# EAGLE board moteus_n1 (EAGLE 9.6.0)
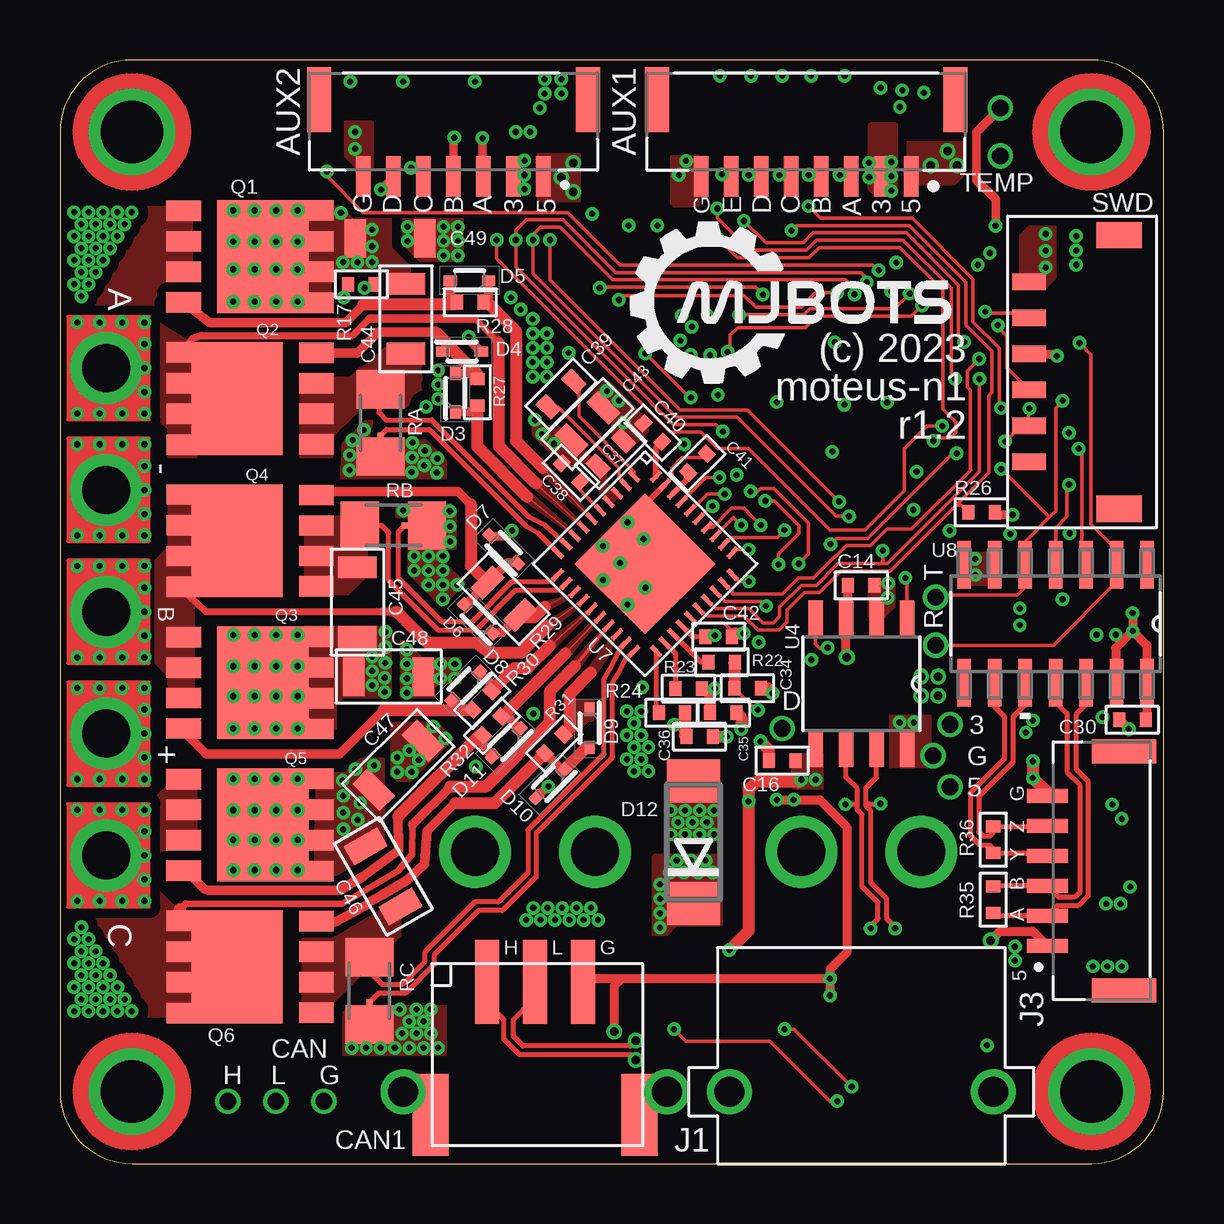
[diagram p8: board, top side]
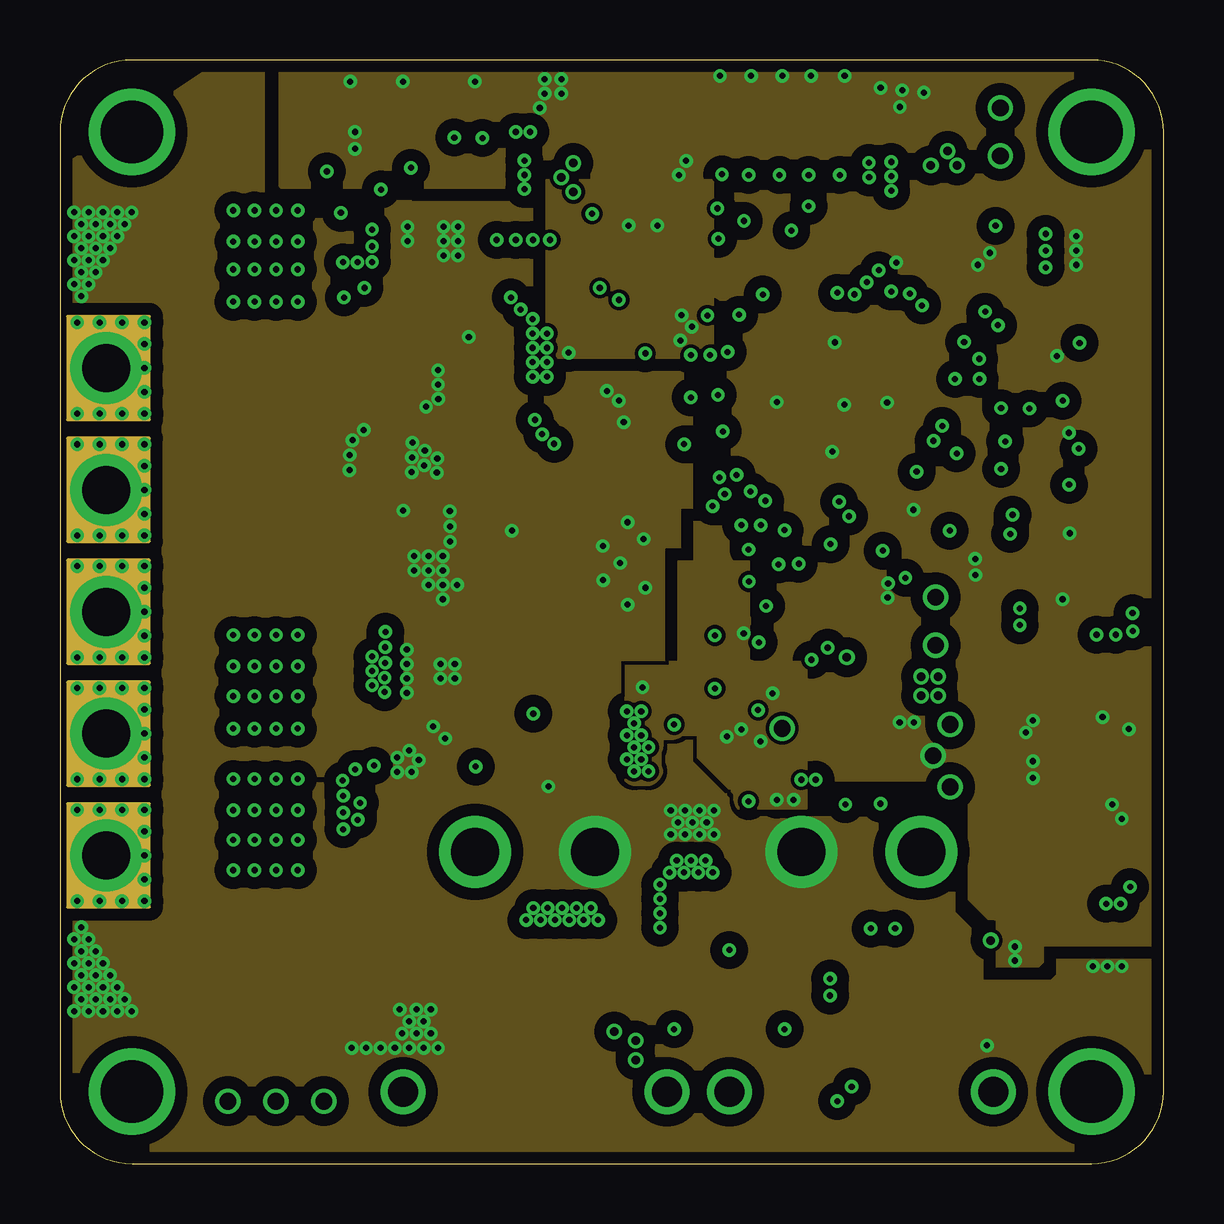
[diagram p9: board, inner layer Route2]
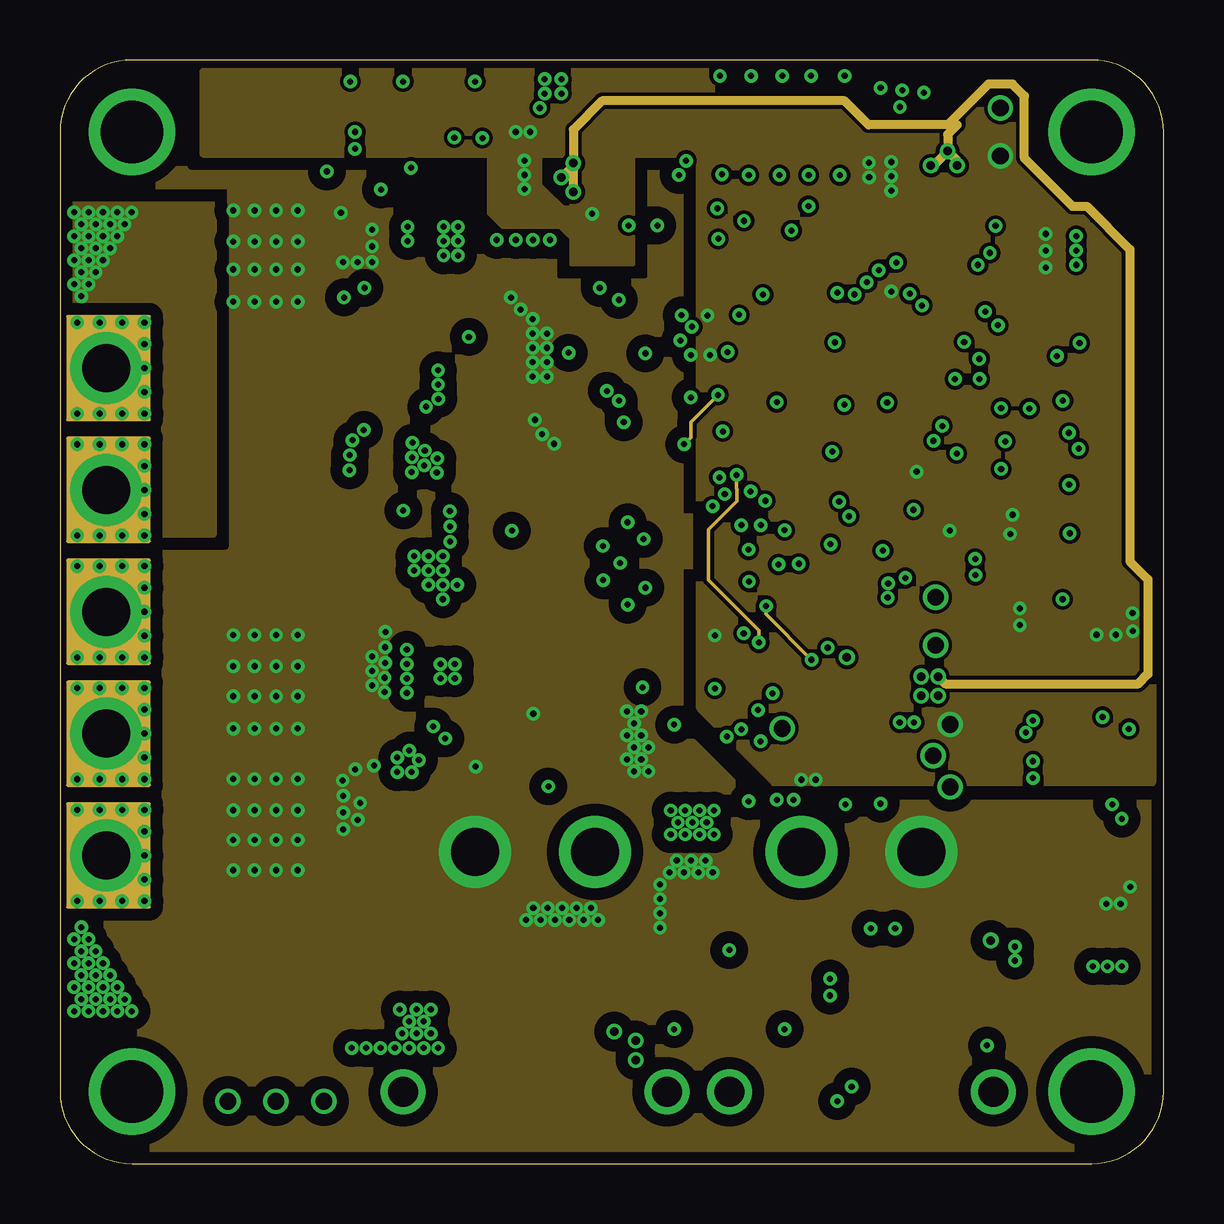
[diagram p10: board, inner layer Route15]
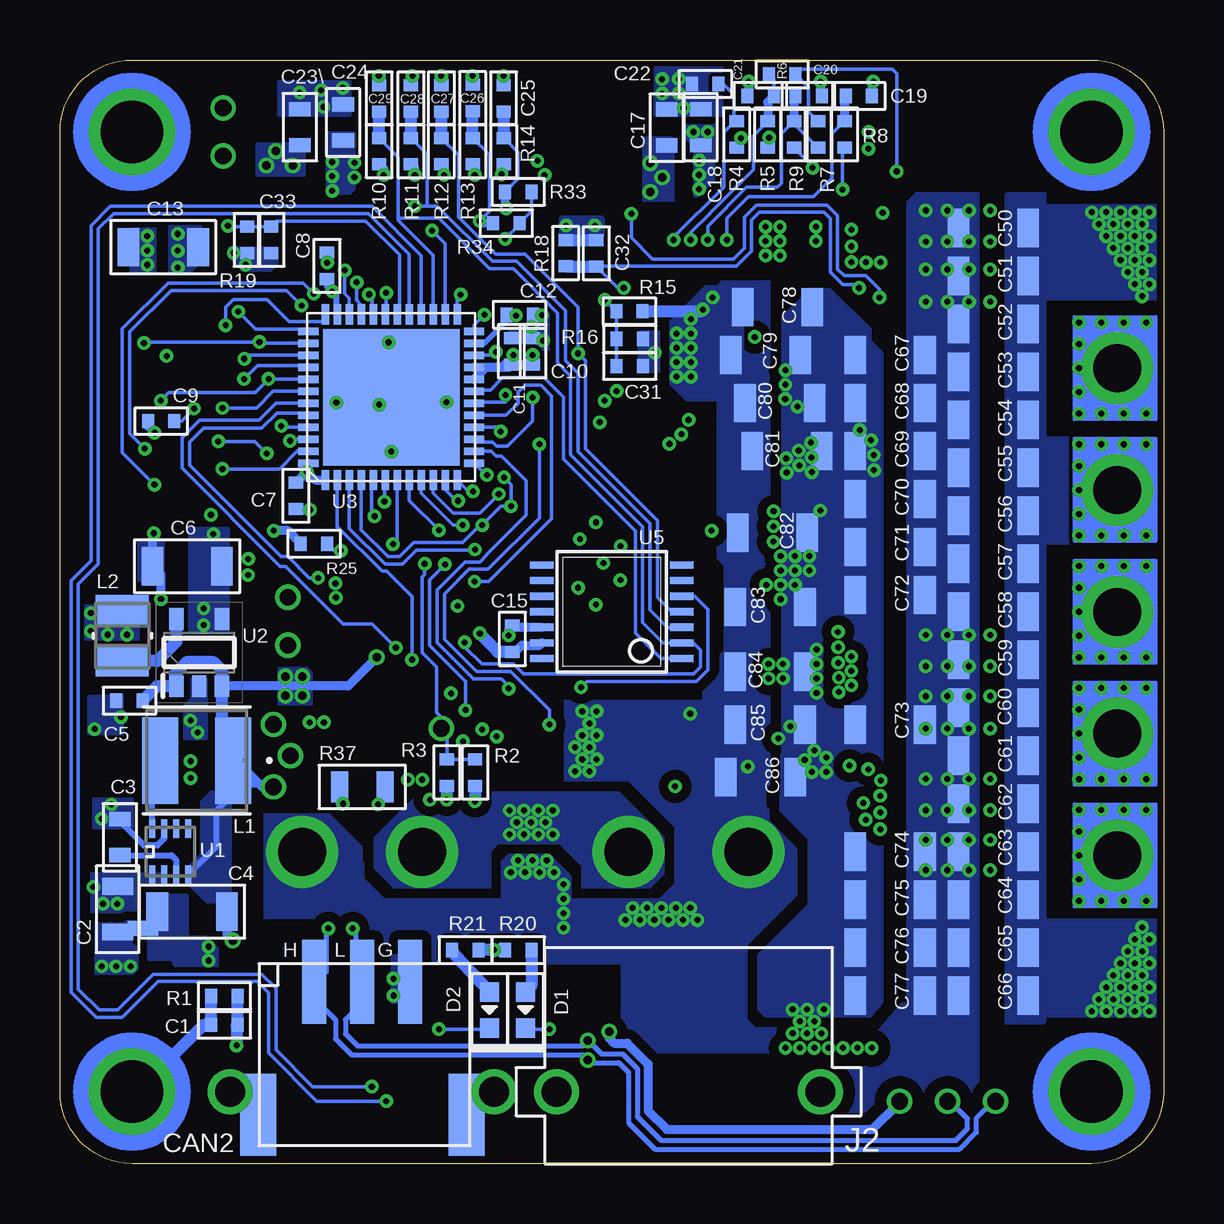
[diagram p11: board, bottom side, seen from below]

Size 46 x 46 mm. Coordinates in mm from the lower left corner, seen from the top.
Outline: 0,43 0,3 arc90 3,0 43,0 arc90 46,3 46,43 arc90 43,46 3,46 arc90 0,43
Copper layers (1*2*15*16): Top 0.07mm / dielectric 0.23mm / Route2 0.035mm / dielectric 0.93mm / Route15 0.035mm / dielectric 0.23mm / Bottom 0.07mm
Design rules "MF_4_mil_drill_4_Layer *": minimum track width 6mil, minimum drill 10mil, track to track 6mil, track to pad 6mil, pad to pad 6mil, via to via 6mil, smd to smd 0mil, copper to edge 10mil, drill to drill 10mil, minimum pad ring 6mil, minimum via ring 6mil, stop-mask expansion 2mil, vias tented up to drill 25mil, thermal gap 10mil
Net classes: 0 default: width 0.127 mm; 1 CAN: width 0.216 mm, clearance 0.127 mm; 2 HV: clearance 0.13 mm; 3 GATE: width 0.384 mm

## Footprints (pad centres in the part's own frame; a part is rotated, then mirrored left to right if it is on the bottom)
16AWG_TERM = drill 2: 1 0,0 | drill 0.254: 2 -1.9,1.6; 3 -1.9,0.667; 4 -1.9,-0.267; 5 -1.9,-1.2; 6 -1,1.6; 7 1.9,1.6; 8 1,1.6; 9 1.9,0.667; 10 1.9,-0.267; 11 1.9,-1.2; 12 0,1.6
JST_SM08B-GHS-TB(LF)(SN) = smd 0.6 x 1.7: 1 -4.375,0; 2 -3.125,0; 3 -1.875,0; 4 -0.625,0; 5 0.625,0; 6 1.875,0; 7 3.125,0; 8 4.375,0 | smd 1 x 2.7: SH1 -6.225,-3.2; SH2 6.225,-3.2
JST_SM07B-GHS-TB(LF)(SN) = smd 0.6 x 1.7: 1 -3.75,1.85; 2 -2.5,1.85; 3 -1.25,1.85; 4 0,1.85; 5 1.25,1.85; 6 2.5,1.85; 7 3.75,1.85 | smd 1 x 2.7: S1 5.6,-1.35; S2 -5.6,-1.35
C0402 = smd 0.5 x 0.6: P$1 -0.55,0; P$2 0.55,0
C0805 = smd 0.7 x 1.3: P$1 -0.95,0; P$2 0.95,0
C0603 = smd 0.6 x 0.9: P$1 -0.75,0; P$2 0.75,0
C1206 = smd 0.9 x 1.6: P$1 -1.45,0; P$2 1.45,0
C1206_NOBORDER = smd 0.9 x 1.6: P$1 -1.45,0; P$2 1.45,0
JST_S3B-PH-SM4-TB(LF)(SN) = smd 1 x 3.5: 1 2,-2.98; 2 0,-2.98; 3 -2,-2.98 | smd 1.5 x 3.4: S1 -4.35,2.57; S2 4.35,2.57
24AWG_PAD = drill 0.7: P$1 0,0
LED0603 = smd 0.8 x 0.8: ANODE 0.75,0; CATHODE -0.75,0
SODFL1608X70N = smd 0.55 x 0.42: 1 -0.8,0; 2 0.8,0
DO214AA = smd 1.8 x 2.2: A 2.55,0; C -2.55,0
XT30PW_MALE = drill 2: 1 -2.5,0; 2 2.5,0 | drill 1.25: M1 -5.5,10; M2 5.5,10
JST_SM06B-GHS-TB(LF)(SN) = smd 0.6 x 1.7: 1 -3.125,1.85; 2 -1.875,1.85; 3 -0.625,1.85; 4 0.625,1.85; 5 1.875,1.85; 6 3.125,1.85 | smd 1 x 2.7: S1 4.975,-1.35; S2 -4.975,-1.35
IND_BOURNS_SRN4018 = smd 1.499 x 3.607: 1 -1.524,0; 2 1.524,0
IND_4024100_WRE = smd 1.295 x 2.21: 1 -1.054,0; 2 1.054,0
M2.5MOUNT = drill 2.6: P$1 0,0
SOP_ADVANCE_8_VIAS = smd 0.85 x 1.45: 1 -1.905,-2.95; 2 -0.635,-2.95; 3 0.635,-2.95; 4 1.905,-2.95 | smd 0.85 x 1.1: 5 1.925,2.75; 6 0.637,2.75; 7 -0.637,2.75; 8 -1.925,2.75 | smd 4.7 x 3.8: PAD 0,0.35
SOP_ADVANCE_8 = smd 0.85 x 1.45: 1 -1.905,-2.95; 2 -0.635,-2.95; 3 0.635,-2.95; 4 1.905,-2.95 | smd 0.85 x 1.1: 5 1.925,2.75; 6 0.637,2.75; 7 -0.637,2.75; 8 -1.925,2.75 | smd 4.7 x 3.8: PAD 0,0.35
R0402 = smd 0.5 x 0.6: P$1 -0.55,0; P$2 0.55,0
R0805 = smd 0.7 x 1.3: P$1 -0.95,0; P$2 0.95,0
M1206 = smd 1.6 x 2: 1 -1.4,0; 2 1.4,0
SHORT_TOP-50 = smd 0.254 x 0.254: 1 0.127,0; 2 -0.127,0
SHORT_TOP-MEDIUM = smd 0.635 x 0.635: 1 0.318,0; 2 -0.318,0
JST_S6B-ZR-SM4A-TF(LF)(SN) = smd 0.7 x 1.4: 1 3.75,0; 2 2.25,0; 3 0.75,0; 4 -0.75,0; 5 -2.25,0; 6 -3.75,0 | smd 1.1 x 1.9: P1 5.7,3.75; P2 -5.7,3.75
21-0487A_MXM = smd 0.762 x 0.254: 1 -0.953,0.75; 2 -0.953,0.25; 3 -0.953,-0.25; 4 -0.953,-0.75; 5 0.953,-0.75; 6 0.953,-0.25; 7 0.953,0.25; 8 0.953,0.75
SOT95P280X130-5N = smd 0.9 x 0.6: 1 -1.4,0.95; 2 -1.4,0; 3 -1.4,-0.95; 4 1.4,-0.95; 5 1.4,0.95
QFN50P700X700X60-49N = smd 0.85 x 0.3: 1 -3.45,2.75; 2 -3.45,2.25; 3 -3.45,1.75; 4 -3.45,1.25; 5 -3.45,0.75; 6 -3.45,0.25; 7 -3.45,-0.25; 8 -3.45,-0.75; 9 -3.45,-1.25; 10 -3.45,-1.75; 11 -3.45,-2.25; 12 -3.45,-2.75; 25 3.45,-2.75; 26 3.45,-2.25; 27 3.45,-1.75; 28 3.45,-1.25; 29 3.45,-0.75; 30 3.45,-0.25; 31 3.45,0.25; 32 3.45,0.75; 33 3.45,1.25; 34 3.45,1.75; 35 3.45,2.25; 36 3.45,2.75 | smd 0.3 x 0.85: 13 -2.75,-3.45; 14 -2.25,-3.45; 15 -1.75,-3.45; 16 -1.25,-3.45; 17 -0.75,-3.45; 18 -0.25,-3.45; 19 0.25,-3.45; 20 0.75,-3.45; 21 1.25,-3.45; 22 1.75,-3.45; 23 2.25,-3.45; 24 2.75,-3.45; 37 2.75,3.45; 38 2.25,3.45; 39 1.75,3.45; 40 1.25,3.45; 41 0.75,3.45; 42 0.25,3.45; 43 -0.25,3.45; 44 -0.75,3.45; 45 -1.25,3.45; 46 -1.75,3.45; 47 -2.25,3.45; 48 -2.75,3.45 | smd 5.7 x 5.7: 49 0,0
SOIC8 = smd 1.549 x 0.61: 1 -2.7,1.905; 2 -2.7,0.635; 3 -2.7,-0.635; 4 -2.7,-1.905; 5 2.7,-1.905; 6 2.7,-0.635; 7 2.7,0.635; 8 2.7,1.905
TSSOP14 = smd 0.305 x 0.991: 1 -1.95,-2.918; 2 -1.3,-2.918; 3 -0.65,-2.918; 4 0,-2.918; 5 0.65,-2.918; 6 1.3,-2.918; 7 1.95,-2.918; 8 1.95,2.918; 9 1.3,2.918; 10 0.65,2.918; 11 0,2.918; 12 -0.65,2.918; 13 -1.3,2.918; 14 -1.95,2.918
WQFN-40 = smd 0.22 x 0.6: 1 2.25,2.9; 2 1.75,2.9; 3 1.25,2.9; 4 0.75,2.9; 5 0.25,2.9; 6 -0.25,2.9; 7 -0.75,2.9; 8 -1.25,2.9; 9 -1.75,2.9; 10 -2.25,2.9; 21 -2.25,-2.9; 22 -1.75,-2.9; 23 -1.25,-2.9; 24 -0.75,-2.9; 25 -0.25,-2.9; 26 0.25,-2.9; 27 0.75,-2.9; 28 1.25,-2.9; 29 1.75,-2.9; 30 2.25,-2.9 | smd 0.6 x 0.22: 11 -2.9,2.25; 12 -2.9,1.75; 13 -2.9,1.25; 14 -2.9,0.75; 15 -2.9,0.25; 16 -2.9,-0.25; 17 -2.9,-0.75; 18 -2.9,-1.25; 19 -2.9,-1.75; 20 -2.9,-2.25; 31 2.9,-2.25; 32 2.9,-1.75; 33 2.9,-1.25; 34 2.9,-0.75; 35 2.9,-0.25; 36 2.9,0.25; 37 2.9,0.75; 38 2.9,1.25; 39 2.9,1.75; 40 2.9,2.25 | smd 4.15 x 4.15: PAD 0,0
D14 = smd 1.981 x 0.559: 1 -2.464,3.81; 2 -2.464,2.54; 3 -2.464,1.27; 4 -2.464,0; 5 -2.464,-1.27; 6 -2.464,-2.54; 7 -2.464,-3.81; 8 2.464,-3.81; 9 2.464,-2.54; 10 2.464,-1.27; 11 2.464,0; 12 2.464,1.27; 13 2.464,2.54; 14 2.464,3.81

## Placement (x,y rotation side)
A  PAD16AWG_TERM  [16AWG_TERM]  1.92,33.16 90 bottom
AUX1  SM08B-GHS-TB(LF)(SN)  [JST_SM08B-GHS-TB(LF)(SN)]  31.1,41.15 180 top
AUX2  SM07B-GHS-TB(LF)(SN)  [JST_SM07B-GHS-TB(LF)(SN)]  16.4,43 180 top
B  PAD16AWG_TERM  [16AWG_TERM]  1.92,23 90 bottom
C  PAD16AWG_TERM  [16AWG_TERM]  1.92,12.84 90 bottom
C1  DNP  [C0402]  39.15,5.78 0 bottom
C2  1uF 100V  [C0805]  43.6,10.6 270 bottom
C3  1uF  [C0603]  43.5,13.6 90 bottom
C4  10uF  [C1206]  40.5,10.5 180 bottom
C5  1uF  [C0402]  43.1,19.3 180 bottom
C6  22uF  [C1206]  40.7,24.9 180 bottom
C7  0.1uF  [C0402]  36.16,27.83 270 bottom
C8  0.1uF  [C0402]  34.87,37.42 90 bottom
C9  0.1uF  [C0402]  41.78,30.95 180 bottom
C10  1uF  [C0402]  26.28,33.86 90 bottom
C11  0.1uF  [C0402]  27.18,33.86 90 bottom
C12  0.1uF  [C0402]  26.84,35.38 0 bottom
C13  10uF  [C1206]  41.69,38.2 0 bottom
C14  0.1uF  [C0402]  33.4,24.1 0 top
C15  0.1uF  [C0402]  27.14,21.87 270 bottom
C16  0.1uF  [C0402]  30.1,16.8 180 top
C17  1uF  [C0603]  20.71,43.18 90 bottom
C18  1uF  [C0603]  19.3,43.2 90 bottom
C19  DNP  [C0402]  12.7,44.5 0 bottom
C20  DNP  [C0402]  14.8,44.5 0 bottom
C21  DNP  [C0402]  16.8,44.5 180 bottom
C22  DNP  [C0402]  19.1,45 180 bottom
C23\  1uF  [C0603]  36,43.2 90 bottom
C24  1uF  [C0603]  34.2,43.4 90 bottom
C25  DNP  [C0402]  27.51,44.4 90 bottom
C26  DNP  [C0402]  28.8,44.41 90 bottom
C27  DNP  [C0402]  30.1,44.4 90 bottom
C28  DNP  [C0402]  31.37,44.4 90 bottom
C29  DNP  [C0402]  32.7,44.4 90 bottom
C30  0.1uF  [C0402]  44.7,18.5 180 top
C31  0.01uF  [C0402]  22.25,33.24 0 bottom
C32  0.1uF  [C0402]  23.64,37.94 90 bottom
C33  0.1uF  [C0402]  37.2,38.5 270 bottom
C34  1000pF  [C0402]  28.66,19.81 0 top
C35  1000pF  [C0402]  27.65,18.79 0 top
C36  1000pF  [C0402]  26.66,17.79 0 top
C37  0.1uF 100V  [C0603]  22.96,29.6 45 top
C38  1uF  [C0402]  21.3,28.8 315 top
C39  0.1uF 100V  [C0603]  20.89,32.07 45 top
C40  1uF  [C0402]  24.71,30.47 315 top
C41  1uF  [C0402]  26.57,29.19 225 top
C42  0.1uF  [C0402]  27.46,21.96 180 top
C43  0.47uF 100V  [C0805]  21.99,30.83 45 top
C44  0.1uF 100V  [C1206]  14.42,35.21 270 top
C45  0.1uF 100V  [C1206]  12.4,23.4 90 top
C46  0.1uF 100V  [C1206]  13.47,11.97 300 top
C47  4.7uF 100V  [C1206]  14.1,16.6 45 top
C48  4.7uF 100V  [C1206]  13.7,20.3 0 top
C49  4.7uF 100V  [C1206_NOBORDER]  13.76,38.57 0 top
C50  4.7uF 100V  [C1206_NOBORDER]  7.1,39 0 bottom
C51  4.7uF 100V  [C1206_NOBORDER]  7.1,37 0 bottom
C52  4.7uF 100V  [C1206_NOBORDER]  7.1,35 0 bottom
C53  4.7uF 100V  [C1206_NOBORDER]  7.1,33 0 bottom
C54  4.7uF 100V  [C1206_NOBORDER]  7.1,31 0 bottom
C55  4.7uF 100V  [C1206_NOBORDER]  7.1,29 0 bottom
C56  4.7uF 100V  [C1206_NOBORDER]  7.1,27 0 bottom
C57  4.7uF 100V  [C1206_NOBORDER]  7.1,25 0 bottom
C58  4.7uF 100V  [C1206_NOBORDER]  7.1,23 0 bottom
C59  4.7uF 100V  [C1206_NOBORDER]  7.1,21 0 bottom
C60  4.7uF 100V  [C1206_NOBORDER]  7.1,19 0 bottom
C61  4.7uF 100V  [C1206_NOBORDER]  7.1,17 0 bottom
C62  4.7uF 100V  [C1206_NOBORDER]  7.1,15 0 bottom
C63  4.7uF 100V  [C1206_NOBORDER]  7.1,13 0 bottom
C64  4.7uF 100V  [C1206_NOBORDER]  7.1,11 0 bottom
C65  4.7uF 100V  [C1206_NOBORDER]  7.1,9 0 bottom
C66  4.7uF 100V  [C1206_NOBORDER]  7.1,7 0 bottom
C67  4.7uF 100V  [C1206_NOBORDER]  11.4,33.7 180 bottom
C68  4.7uF 100V  [C1206_NOBORDER]  11.4,31.7 180 bottom
C69  4.7uF 100V  [C1206_NOBORDER]  11.4,29.7 180 bottom
C70  4.7uF 100V  [C1206_NOBORDER]  11.4,27.7 180 bottom
C71  4.7uF 100V  [C1206_NOBORDER]  11.4,25.7 180 bottom
C72  4.7uF 100V  [C1206_NOBORDER]  11.4,23.7 180 bottom
C73  4.7uF 100V  [C1206_NOBORDER]  11.4,18.3 180 bottom
C74  4.7uF 100V  [C1206_NOBORDER]  11.4,13 180 bottom
C75  4.7uF 100V  [C1206_NOBORDER]  11.4,11 180 bottom
C76  4.7uF 100V  [C1206_NOBORDER]  11.4,9 180 bottom
C77  4.7uF 100V  [C1206_NOBORDER]  11.4,7 180 bottom
C78  4.7uF 100V  [C1206_NOBORDER]  16.1,35.7 0 bottom
C79  4.7uF 100V  [C1206_NOBORDER]  16.6,33.7 0 bottom
C80  4.7uF 100V  [C1206_NOBORDER]  16,31.7 0 bottom
C81  4.7uF 100V  [C1206_NOBORDER]  15.7,29.7 0 bottom
C82  4.7uF 100V  [C1206_NOBORDER]  16.3,26.3 0 bottom
C83  4.7uF 100V  [C1206_NOBORDER]  16.4,23.2 0 bottom
C84  4.7uF 100V  [C1206_NOBORDER]  16.4,20.5 0 bottom
C85  4.7uF 100V  [C1206_NOBORDER]  16.4,18.3 0 bottom
C86  4.7uF 100V  [C1206_NOBORDER]  16.8,16.1 0 bottom
CAN1  JST-PH3  [JST_S3B-PH-SM4-TB(LF)(SN)]  19.8,4.6 180 top
CAN2  JST-PH3  [JST_S3B-PH-SM4-TB(LF)(SN)]  33.4,4.6 180 bottom
CANG  PAD24AWG_PAD  [24AWG_PAD]  11,2.6 0 top
CANH  PAD24AWG_PAD  [24AWG_PAD]  7,2.6 0 top
CANL  PAD24AWG_PAD  [24AWG_PAD]  9,2.6 0 top
D1  MF-LED-0603-RED  [LED0603]  26.6,6.4 90 bottom
D2  MF-LED-0603-RED  [LED0603]  28.1,6.4 90 bottom
D3  BAT41KFILM  [SODFL1608X70N]  16.48,32.13 90 top
D4  BAT41KFILM  [SODFL1608X70N]  16.76,33.85 0 top
D5  BAT41KFILM  [SODFL1608X70N]  17.07,36.81 180 top
D6  BAT41KFILM  [SODFL1608X70N]  17.45,22.7 135 top
D7  BAT41KFILM  [SODFL1608X70N]  18.5,25.6 135 top
D8  BAT41KFILM  [SODFL1608X70N]  16.91,19.91 225 top
D9  BAT41KFILM  [SODFL1608X70N]  22.07,18.14 270 top
D10  BAT41KFILM  [SODFL1608X70N]  20.43,15.83 225 top
D11  BAT41KFILM  [SODFL1608X70N]  18.61,17.54 225 top
D12  [DO214AA]  26.4,13.4 90 top
D33  PAD24AWG_PAD  [24AWG_PAD]  37.1,18.3 0 top
D50  PAD24AWG_PAD  [24AWG_PAD]  37.1,15.7 0 top
DAC  PAD24AWG_PAD  [24AWG_PAD]  30.1,18.14 180 top
DG1  PAD24AWG_PAD  [24AWG_PAD]  36.4,17 0 top
DTR  PAD24AWG_PAD  [24AWG_PAD]  36.5,21.6 0 top
DTX  PAD24AWG_PAD  [24AWG_PAD]  36.5,23.6 0 top
J1  XT30XT30PW_MALE  [XT30PW_MALE]  33.4,13 180 top
J2  XT30XT30PW_MALE  [XT30PW_MALE]  19.8,13 180 bottom
J3  SM06B-GHS-TB(LF)(SN)  [JST_SM06B-GHS-TB(LF)(SN)]  43,12.2 90 top
L1  SRN4018-220M  [IND_BOURNS_SRN4018]  40.3,16.8 180 bottom
L2  74404024100  [IND_4024100_WRE]  43.4,22 270 bottom
M1  MOUNT  [M2.5MOUNT]  3,3 0 top
M2  MOUNT  [M2.5MOUNT]  3,43 0 top
M3  MOUNT  [M2.5MOUNT]  43,3 0 top
M4  MOUNT  [M2.5MOUNT]  43,43 0 top
Q1  TPH1R204PL_VIAS  [SOP_ADVANCE_8_VIAS]  8.11,37.8 270 top
Q2  TPH1R204PLSOP_ADVANCE_8  [SOP_ADVANCE_8]  7.74,31.88 90 top
Q3  TPH1R204PL_VIAS  [SOP_ADVANCE_8_VIAS]  8.11,20.04 270 top
Q4  TPH1R204PLSOP_ADVANCE_8  [SOP_ADVANCE_8]  7.74,25.96 90 top
Q5  TPH1R204PL_VIAS  [SOP_ADVANCE_8_VIAS]  8.11,14.12 270 top
Q6  TPH1R204PLSOP_ADVANCE_8  [SOP_ADVANCE_8]  7.74,8.2 90 top
R1  DNP  [R0402]  39.15,6.98 0 bottom
R2  DNP  [R0402]  28.7,16.3 270 bottom
R3  100k 1%  [R0402]  29.87,16.3 90 bottom
R4  100  [R0402]  17.8,42.9 90 bottom
R5  100  [R0402]  16.5,42.9 90 bottom
R6  2k  [R0402]  15.9,45.4 180 bottom
R7  2k  [R0402]  14.4,42.9 270 bottom
R8  100  [R0402]  13.3,42.9 90 bottom
R9  100  [R0402]  15.4,42.9 90 bottom
R10  100  [R0402]  32.7,42.2 90 bottom
R11  100  [R0402]  31.37,42.2 90 bottom
R12  100  [R0402]  30.11,42.2 90 bottom
R13  100  [R0402]  28.8,42.2 90 bottom
R14  100  [R0402]  27.5,42.2 90 bottom
R15  100k 1%  [R0402]  22.26,35.53 0 bottom
R16  4.7k 1%  [R0402]  22.25,34.37 180 bottom
R17  47k NTC  [R0402]  12.56,36.65 0 top
R18  10k 1%  [R0402]  24.92,37.95 90 bottom
R19  10k 1%  [R0402]  38.2,38.5 270 bottom
R20  560  [R0402]  26.9,8.9 0 bottom
R21  560  [R0402]  29.1,8.9 180 bottom
R22  22  [R0402]  27.59,20.9 0 top
R23  22  [R0402]  26.2,19.8 0 top
R24  22  [R0402]  25.51,18.8 0 top
R25  2k  [R0402]  35.41,25.84 0 bottom
R26  2k  [R0402]  38.41,27.14 180 top
R27  7.5  [R0402]  17.4,32.15 90 top
R28  7.5  [R0402]  17.1,35.9 180 top
R29  7.5  [R0805]  18.5,23.54 135 top
R30  7.5  [R0402]  17.6,19.3 225 top
R31  7.5  [R0402]  20.6,17.5 225 top
R32  7.5  [R0402]  18.02,18.24 225 top
R33  2k  [R0402]  26.9,40.5 180 bottom
R34  2k  [R0402]  27.4,39.2 180 bottom
R35  120  [R0402]  38.9,11 270 top
R36  120  [R0402]  38.9,13.5 270 top
R37  DNP  [R0805]  33.4,15.7 0 bottom
RA  0.5mOhm 1% 2W  [M1206]  13.36,30.87 90 top
RB  0.5mOhm 1% 2W  [M1206]  13.9,26.6 180 top
RC  0.5mOhm 1% 2W  [M1206]  12.9,7.2 90 top
SH1  SHORTT5  [SHORT_TOP-50]  13.36,30.22 90 top
SH2  SHORTT5  [SHORT_TOP-50]  14.5,26.6 180 top
SH3  SHORTT5  [SHORT_TOP-50]  12.9,6.6 90 top
SH4  SHORTMEDIUM  [SHORT_TOP-MEDIUM]  42.54,9.8 180 bottom
SWD  JST-ZH6  [JST_S6B-ZR-SM4A-TF(LF)(SN)]  40.4,33 270 top
TEMP1  PAD24AWG_PAD  [24AWG_PAD]  39.2,42 0 top
TEMP2  PAD24AWG_PAD  [24AWG_PAD]  39.2,44 0 top
U1  MAX15062AATA+T  [21-0487A_MXM]  41.4,13 90 bottom
U2  XC9265A331MR-G  [SOT95P280X130-5N]  40.2,21.3 90 bottom
U3  STM32G474CEU6  [QFN50P700X700X60-49N]  32.19,31.94 90 bottom
U4  TCAN1042HGV  [SOIC8]  33.4,20 270 top
U5  AS5147  [TSSOP14]  23,23 90 bottom
U7  DRV8353S  [WQFN-40]  24.39,25 45 top
U8  SN65HVD35DR  [D14]  41.5,22.5 270 top
VN  PAD16AWG_TERM  [16AWG_TERM]  1.92,28.08 90 bottom
VP  PAD16AWG_TERM  [16AWG_TERM]  1.92,17.92 90 bottom

## Tracks (layer width: path | path; a pad name or v marks a point on that pad's centre or on a via)
+3V3  (via drill 0.25)
  Top 0.152: R17.P$1 11.84,36.48 v11.84,36.1
  Top 0.2: U7.24 26.37,21.96 C42.P$2
  Top 0.384: AUX2.2 18.96,41.21 v19.36,41.21 | C42.P$2 26.96,22.01 v27.3,22.01 | v44.72,22.19 45.31,21.6 U8.14 45.31,18.56 C30.P$1 | v44.71,22.94 v44.72,22.93 v44.72,22.19 | U8.13 44.01,20.07 44.01,21.48 v44.72,22.19 | v39.71,27.04 39.06,27.04 R26.P$1
  Top 0.5: v30.9,16 30.8,15.9 29,15.9 28.7,15.6 v28.7,15.1 28.7,9.7 v27.9,8.9
  Bottom 0.152: v11.84,36.1 11.84,36.44 12.41,37.01 13.31,37.01 13.59,37.29 13.59,39.52 14.02,39.95 16.98,39.95 17.48,39.46 17.48,38.16 17.93,37.7 21.3,37.7 22.18,38.59 v22.18,39.59
  Bottom 0.2: U3.23 28.31,34.19 28.06,34.44 27.39,35.11 C12.P$1
  Bottom 0.25: C8.P$1 34.87,36.57 v34.65,36.35 34.49,36.19 34.49,35.44 U3.35
  Bottom 0.384: v27.3,22.01 27.3,22.26 C15.P$1 27.07,22.35 U5.12 | U3.20 28.23,33.2 27.57,33.2 27.46,33.31 C11.P$1 | U3.21 27.3,33.19 C11.P$1 | C11.P$1 C10.P$1 26.3,33.33 v26.3,33.7 | v27.1,33.7 27.1,33.39 C11.P$1 | C12.P$1 27.36,35.35 v26.99,35.35 | U3.48 35.71,29.12 v35.71,28.84 | v35.71,28.84 C7.P$1 | v35.71,28.84 35.36,28.49 U3.1 | R25.P$1 36.5,26.38 v37.09,26.38
  Bottom 0.5: R2.P$2 v28.7,15.1 | R21.P$1 v27.9,8.9 R20.P$1
  other vias: 19,43 19.6,43 19.36,41.81 19.36,40.62 31.5,16 33.73,41.11 33.72,41.72 34.65,41.75 34.65,41.15 34.65,40.55 41.09,38.75 41.09,38.05 41.09,37.35 44.01,22.04 43.21,22.04 40.01,23.14 40.01,22.44 39.61,26.24
  pour Route15 (no thermals): 6,45.5 41.9,45.5 45.4,42 45.5,42 45.5,15.9 29.8,15.9 26.7,19 26.7,42.1 6,42.1
  pour Bottom (no thermals): 40.6,26.5 39,26.5 39,22.2 40.6,22.2
  pour Route15 (no thermals): 21.3,42.3 23.9,42.3 23.9,37.45 21.3,37.45
  pour Bottom (no thermals): 18.7,43.3 19.9,43.3 19.9,42.7 19.6,42.4 19.6,40.3 19.4,40.3 18.8,40.9 18.7,41
  pour Top (no thermals): 30.5,17.1 31.8,17.1 31.8,15.6 30.6,15.6 30.5,15.7
  pour Top (no thermals): 33.8,43.4 34.8,43.4 34.9,43.3 34.9,40.4 33.9,40.4 33.7,40.6 33.7,42.4 33.7,43.3
  pour Bottom (no thermals): 33.7,43 34.9,43 34.9,40.4 33.9,40.4 33.7,40.6
  pour Top (no thermals): 40.4,39.1 41.5,39.1 41.5,36.9 41.1,36.5 40.7,36.5 40,36.5 40,38.7
  pour Bottom (no thermals): 40.1,39.1 41.5,39.1 41.5,37.1 40.6,37.1 40.1,37.6
  pour Bottom (no thermals): 45,23.3 42.7,23.3 42.7,21.8 45,21.8
  pour Route15 (no thermals): 21.7,39.9 21,39.9 20.3,40.6 20.1,40.8 20.1,42.4 18.1,42.4 17.8,42.1 17.8,39.6 18.4,39 20.8,39 21.5,38.3 21.7,38.3
+5V  (via drill 0.35)
  Top 0.384: v38.8,9.3 39.18,9.68 40.54,9.68 J3.1 | v32.8,21.1 32.77,21.14 U4.3 32.85,22.79 C14.P$1
  Route15 0.384: v36.6,20.3 36.9,20 44.95,20 45.35,20.4 45.35,24.35 44.6,25.1 44.6,38.1 42.8,39.9 42.2,39.9 40.2,41.9 40.2,44.5 39.7,45 38.7,45 37,43.3 | v37,42.2 37,42.9 37.4,43.3 37,43.3 | v37,42.2 37.4,41.8 v37.4,41.6 | v37,42.2 36.4,41.6 v36.3,41.6 | 37,43.3 33.7,43.3 32.7,44.3 22.6,44.3 21.4,43.1 v21.4,41.7 | v21.4,40.5 v21.4,41.7 | v21.4,41.7 21.4,41.6 v20.9,41.1
  Bottom 0.152: v36.6,20.3 37,19.9 U2.3
  Bottom 0.254: D50.P$1 37.2,15.8 38.1,15.8 38.7,15.2 39,15.2 39.5,14.7 39.5,13.2 U1.4
  Bottom 0.384: U2.3 34,19.9 v32.8,21.1 | C4.P$1 39.05,9.55 v38.8,9.3 | L1.1 38.68,16.8 37.58,15.7 D50.P$1
  Bottom 0.5: C5.P$1 41.95,19.9 41.2,19.9 | 41.2,19.9 U2.1 | L1.1 39.25,17.27 U2.3 39.25,20.55 39.6,20.9 40.72,20.9 41.2,20.42 41.2,19.9
  other vias: 36.6,19.5 35.9,20.3 35.9,19.5
  pour Bottom (no thermals): 39.7,15.5 38.9,15.5 38.9,10.9 39.9,10.9 40.7,11.7 40.7,12.3 40.1,12.9 40.1,15.1
  pour Bottom (no thermals): 35.8,42.5 37.8,42.5 37.8,41.2 35.8,41.2
  pour Bottom (no thermals): 36.9,20.7 35.7,20.7 35.5,20.5 35.5,19.1 36.9,19.1
  pour Top (no thermals): 37.7,42.6 35.3,42.6 35.3,40.8 37.3,40.8 37.7,41.2
  pour Top (no thermals): 21.7,42.1 19.9,42.1 19.9,40.2 20,40.1 21.7,40.1
  pour Bottom (no thermals): 21.7,42.8 20.5,42.8 20.4,42.7 20.4,40.1 21.7,40.1
AS5047_CS
  Bottom 0.152: U3.19 28.68,32.25 28.05,32.25 27.55,32.75 25.82,32.75 25.02,31.94 25.02,29.37 22.01,26.37 22.01,22.12 20.95,21.05 U5.1
AUX1_A  (via drill 0.25)
  Route15 0.152: v28.2,28.7 28.2,28.13 28.22,28.12 28.22,27.62 27.03,26.43 27.03,24.32 29.13,22.22 v29.13,21.72
  Bottom 0.152: U3.13 28.25,28.7 v28.2,28.7 | 31.9,39.4 30.2,39.4 28.1,37.3 27.1,37.3 25.25,35.45 25.25,33.38 24.71,32.83 24.71,29.55 21.71,26.55 21.71,22.54 20.86,21.7 U5.2 19.6,21.7 19.3,21.4 19.3,20.7 19.6,20.4 26.67,20.4 27.08,20.82 28.41,20.82 29.13,21.53 v29.13,21.72 | R10.P$2 31.9,41.95 31.9,39.4 | U3.27 30.44,37.87 31.9,39.33 31.9,39.4
  Bottom 0.5: R10.P$2 C29.P$1
AUX1_B  (via drill 0.25)
  Top 0.152: v39.23,31.49 39.15,31.57 39.15,33.98 38.06,35.07 38.06,36.87 35.53,39.41 31.7,39.41 v31.2,39.91
  Bottom 0.152: 30.7,39.91 30.27,39.91 27.97,37.6 26.97,37.6 24.92,35.55 24.92,33.47 24.41,32.96 24.41,29.67 21.41,26.67 21.41,23.07 20.68,22.35 U5.3 | R11.P$2 30.7,42.08 30.7,39.91 | U3.42 37.11,32.19 37.81,31.49 v39.23,31.49 | v31.2,39.91 30.7,39.91
  Bottom 0.5: R11.P$2 C28.P$1
AUX1_C  (via drill 0.25)
  Top 0.152: v26.3,31.93 26.24,31.93 v24.4,33.77
  Bottom 0.152: U3.15 28.62,30.07 27.97,30.07 27.8,29.9 27.34,29.9 26.3,30.94 v26.3,31.93 | R12.P$2 29.38,42.02 29.38,39.44 27.85,37.91 26.61,37.91 24.4,35.7 v24.4,33.77 24.1,33.47 24.1,29.8 21.1,26.8 21.1,23.6 20.5,23 U5.4
  Bottom 0.5: R12.P$2 C27.P$1
AUX1_D  (via drill 0.25)
  Top 0.152: v37.69,34.25 37.45,34.48 37.45,36.62 35.27,38.8 31.39,38.8 30.98,38.38 29.42,38.38 v28.51,39.29 | v42.5,34.2 42.97,33.73 42.97,26.66 44.04,25.59 U8.2 43.98,24.9 43.98,24.18 41.4,21.6 DTR.P$1
  Bottom 0.152: U3.38 37.63,34.19 v37.69,34.25 38.88,34.25 38.89,34.23 42.47,34.23 v42.5,34.2 | 28.42,39.2 v28.51,39.29 28.1,39.7 28.1,42.05 R13.P$2
  Bottom 0.348: 28.42,39.2 R34.P$2
  Bottom 0.5: R13.P$2 C26.P$1
AUX1_E  (via drill 0.25)
  Top 0.152: v37.31,32.7 37.15,32.86 37.15,36.48 35.14,38.49 31.52,38.49 31.11,38.08 28.73,38.08 27.4,39.4 v27.4,39.81 | v41.8,31.8 41.5,31.5 41.5,27.2 41.24,26.94 | 41.24,26.94 40.23,25.93 U8.5 40.23,24.03 39.9,23.7 36.6,23.7 DTX.P$1 | v39.23,28.95 41.24,26.94
  Bottom 0.152: U3.41 37.3,32.69 v37.31,32.7 37.87,32.14 41.46,32.14 v41.8,31.8 | v27.4,39.81 27.45,39.86 | U3.47 36.11,29.69 36.85,28.95 v39.23,28.95 | R33.P$2 26.9,41.05 26.9,42.15 R14.P$2
  Bottom 0.348: 27.45,39.86 R33.P$2
  Bottom 0.5: R14.P$2 C25.P$1
AUX1_I2C_PULLUP  (via drill 0.25)
  Top 0.152: v36.41,30.13 36.52,30.23 37.1,30.23 37.34,30.47 37.34,30.9 36.8,31.44 36.8,36.4 35.01,38.19 31.65,38.19 31.22,37.76 28.23,37.76 v27.44,38.55
  Bottom 0.152: U3.46 36.35,30.19 v36.41,30.13 | v27.44,38.55 26.85,39.14 R34.P$1 26.35,39.7 R33.P$1
AUX2_A  (via drill 0.25)
  Top 0.152: v32.48,27.59 v32.47,27.59 28.65,31.41 25.84,31.41 25.21,32.04 20.42,36.83 v20.42,38.5
  Bottom 0.152: U3.6 32.48,28.45 v32.48,27.59 | v20.42,38.5 20.42,38.61 18.33,40.7 18.33,42.99 17.87,43.45 R4.P$2 17.9,43.55 17.9,44.55 18.35,45 C22.P$1
AUX2_B  (via drill 0.25)
  Top 0.152: v32.89,26.98 32.35,26.98 28.23,31.11 25.68,31.11 25.02,31.77 25.02,31.79 19.71,37.1 v19.71,38.5 19.71,38.71 20.03,39.03 20.83,39.03 23.03,36.84 32.74,36.84 33.12,36.46 v33.12,36.23
  Bottom 0.152: U3.5 33.02,28.41 33.02,27.11 v32.89,26.98 | v19.71,38.5 19.71,38.8 18.91,39.6 18.91,39.61 17.1,41.42 17.1,42.85 R5.P$2 | U3.32 33,35.45 33,36.11 v33.12,36.23 | R6.P$2 16.25,45.2 C21.P$1
  Bottom 0.384: C21.P$1 16.5,44.25 R5.P$2
AUX2_C  (via drill 0.25)
  Top 0.152: v27.63,30.52 27.35,30.8 25.56,30.8 24.61,31.75 24.61,31.76 19,37.37 v19,38.5 19,38.9 19.44,39.34 20.96,39.34 23.15,37.15 33.38,37.15 33.63,36.89 v33.63,36.73
  Bottom 0.152: U3.16 27.8,30.69 v27.63,30.52 | v19,38.5 19,39.08 17.38,40.7 16.1,40.7 15.93,40.87 15.93,42.92 R9.P$2 15.4,43.35 R7.P$2 | v33.63,36.73 33.63,35.98 33.44,35.79 U3.33
  Bottom 0.384: C20.P$1 15.4,44.45 R9.P$2
AUX2_D  (via drill 0.25)
  Top 0.152: v36.77,30.74 36.14,30.74 35.2,29.8 35.2,28.04 33.56,26.41 32.09,26.41 28.7,29.8 27.41,29.8 26.73,30.49 25.44,30.49 24.09,31.84 24.08,31.84 18.2,37.72 v18.2,38.5
  Bottom 0.152: U3.45 36.72,30.69 v36.77,30.74 | v18.2,38.5 18.2,39.4 17.3,40.3 14.6,40.3 13.83,41.07 13.83,42.92 R8.P$2
  Bottom 0.384: C19.P$1 13.3,44.45 R8.P$2
AUX2_I2C_PULLUP  (via drill 0.25)
  Top 0.152: v34.13,37.24 34.11,37.24 33.9,37.45 23.35,37.45 21.16,39.64 12.63,39.64 11.12,41.15 v11.12,41.35
  Bottom 0.152: v34.13,37.24 34.14,37.23 34.14,36.27 33.94,36.07 U3.34 | v11.12,41.35 11.12,45.42 11.31,45.61 15.14,45.61 R6.P$1 14.8,44.85 14.8,43.85 R7.P$1
CAN_N  (via drill 0.25, 0.35)
  Top 0.216: U4.6 32.77,16.09 33.23,15.63 33.23,15 | v33.8,9.8 33.8,9.9 34.1,10.2 34.1,10.88 33.43,11.55 33.43,14.55 33.23,14.75 33.23,15 | CAN1.2 19.7,6.8 18.9,6 18.9,5.3 19.3,4.9 23.78,4.9 v24,5.12 | 33.23,15 33.2,14.97 v32.74,14.97
  Bottom 0.216: v33.8,9.8 33.69,9.69 33.69,8.99 33.3,8.39 CAN2.2 33.3,6.79 34.1,5.99 34.1,5.4 33.6,4.9 24.22,4.9 v24,5.12 23.78,4.9 23.76,4.9 23.43,4.57 22.55,4.57 21.93,3.95 21.93,1.95 20.95,0.97 8.65,0.97 8.17,1.45 8.17,1.87 8.9,2.6 CANL.P$1 | v32.74,14.97 32.45,15.26 R37.P$2
CAN_P  (via drill 0.25, 0.35)
  Top 0.216: U4.7 34.03,16.09 33.6,15.66 33.6,14.9 | v34.81,9.8 34.74,9.87 34.74,9.92 34.47,10.2 34.47,11.03 33.8,11.7 33.8,14.7 33.6,14.9 | CAN1.1 17.7,6.8 18.5,6 18.5,5.18 19.15,4.53 23.78,4.53 v24,4.31 | 33.6,14.9 33.7,15 v34.2,15
  Bottom 0.216: v34.81,9.8 34.9,9.71 34.9,7.98 CAN2.1 35.3,6.78 34.52,6 34.52,5.2 33.85,4.53 24.22,4.53 v24,4.31 23.89,4.2 22.7,4.2 22.3,3.8 22.3,1.7 21.2,0.6 8.5,0.6 7.8,1.3 7.8,1.9 7.1,2.6 CANH.P$1 | v34.2,15 34.35,15.15 R37.P$1
CAN_RX  (via drill 0.25)
  Top 0.152: U4.4 31.5,21.65 31.67,21.47 31.97,21.47 v32,21.5
  Bottom 0.152: U3.43 36.99,31.69 37.7,30.98 40.18,30.98 40.9,30.26 40.9,28.98 36.81,24.89 36.59,24.89 34.2,22.5 33,22.5 v32,21.5
CAN_TX  (via drill 0.25)
  Top 0.152: v35.24,24.41 35.3,24.41 U4.1
  Bottom 0.152: U3.44 35.74,31.29 36.95,31.29 37.58,30.66 40.02,30.66 40.59,30.08 40.59,29.11 36.79,25.3 36.5,25.3 35.61,24.41 v35.24,24.41
CUR1
  Top 0.2: U7.23 26.72,20.9 R22.P$1
CUR2
  Top 0.2: U7.22 25.65,21.27 R23.P$1
CUR3
  Top 0.152: 24.85,18.91 R24.P$1
  Top 0.2: U7.21 24.85,18.91
DAC  (via drill 0.25)
  Top 0.152: v28.79,28.02 29.07,28.02 29.19,28.13 29.77,28.13 31.2,26.7 31.2,25.4 v30.8,25
  Bottom 0.152: U3.12 28.96,28.02 v28.79,28.02 | v30.8,25 30.8,24.56 30.91,24.45 30.91,21.3 30.3,20.7 30.3,18.8 30.1,18.6 DAC.P$1 29.87,17.91 R3.P$2 R2.P$1
DRV8323_CS  (via drill 0.25)
  Top 0.152: U7.30 28.31,24.26 v28.72,24.26
  Bottom 0.152: v28.72,24.26 28.14,24.26 25.5,26.89 25.5,32 25.95,32.45 26.6,32.45 26.9,32.15 26.9,31.69 27.4,31.19 U3.17
DRV8323_MISO  (via drill 0.25)
  Top 0.152: U7.27 27.32,23.13 28.71,23.13 29.3,22.54 29.74,22.54 29.99,22.79 29.99,23.19 30.9,24.1 31.53,24.1 32.44,25 34.2,25 | v38.33,32.7 38.31,32.69 38.31,28.84 34.48,25 34.2,25 | v34.3,25.55 34.3,25.11 34.2,25
  Bottom 0.152: v38.33,32.7 37.76,33.27 35.72,33.27 U3.40 | R25.P$2 34.57,25.55 v34.3,25.55
DRV8323_MOSI  (via drill 0.25)
  Top 0.152: U7.28 27.72,23.44 29.23,23.44 v29.43,23.24
  Route15 0.152: v31.33,21 29.43,22.9 v29.43,23.24
  Bottom 0.152: U3.2 34.44,26.54 34.43,26.54 32.58,24.69 32.39,24.69 31.33,23.63 v31.33,21
DRV8323_SCLK  (via drill 0.25)
  Top 0.152: v38.32,33.54 37.82,33.04 37.82,32.37 37.95,32.24 37.95,28.91 37.96,28.91 35.49,26.44 34.47,26.44 33.78,25.75 32.77,25.75 32.33,25.31 32.31,25.31 31.41,24.41 30.78,24.41 30.11,23.75 28.06,23.75 28,23.8 28,23.86 U7.29
  Bottom 0.152: U3.39 38.17,33.69 v38.32,33.54
FCUR1  (via drill 0.25)
  Top 0.152: v29.4,27.62 29.78,27.62 30.8,26.6 30.8,26.26 29.95,25.41 v29.95,24.97 | v29.1,18.9 29.02,18.9 C34.P$1
  Top 0.5: R22.P$2 28.11,20.87 C34.P$1
  Bottom 0.152: v29.4,27.62 29.5,27.62 29.61,27.74 29.59,27.74 29.94,28.09 U3.11 | v29.95,24.97 30.6,24.32 30.6,21.6 29.1,20.1 v29.1,18.9
FCUR2  (via drill 0.25)
  Top 0.152: v27.3,19.8 R23.P$2
  Top 0.5: v27.3,19.8 27.1,19.6 C35.P$1
  Bottom 0.152: U3.14 28.02,29.69 27.83,29.5 27.59,29.5 26.57,28.47 26.57,27.03 28.19,25.41 28.19,25.38 28.49,25.08 29.11,25.08 30.28,23.91 30.28,21.71 28.77,20.2 27.6,20.2 27.25,19.85 v27.3,19.8
FCUR3  (via drill 0.25)
  Top 0.152: v25.6,18.3 26.05,17.85 C36.P$1
  Top 0.5: R24.P$2 26.05,17.85
  Route15 0.152: v27.43,32.04 26.3,30.91 26.3,30.26 v26.02,29.98
  Bottom 0.152: U3.18 28.68,31.75 27.43,31.75 v27.43,32.04 | v26.02,29.98 26.02,26.91 28.16,24.77 28.95,24.77 29.98,23.75 29.98,21.84 28.64,20.51 27.21,20.51 25.6,18.9 v25.6,18.3
GHA
  Top 0.05: U7.6 20.12,29
  Top 0.384: R28.P$1 17.87,36.12 D5.1
  Top 0.5: R28.P$1 17.8,35.9 19,34.7 19,30.12 20.12,29
  pour Top (no thermals): 22.03,27.12 21.92,27.01 19.98,28.82 20.31,29.13
GHA_D
  Top 0.384: R28.P$2 16.27,36.18 D5.2
  Top 0.4: Q1.4 6.24,35.06 11.9,35.06 12.65,35.81
  Top 0.5: R28.P$2 16.46,35.81 12.65,35.81
GHB
  Top 0.05: U7.15 20.42,21.58
  Top 0.384: R30.P$1 17.99,19.96 D8.1
  Top 0.5: 20.42,21.58 19.49,20.65 18.95,20.65 R30.P$1
  pour Top (no thermals): 21.91,23 22.04,22.88 20.6,21.45 20.31,21.77
GHB_D
  Top 0.384: R30.P$2 16.78,18.91 D8.2
  Top 0.4: 5.16,18 6.09,17.08 11.66,17.08 13.49,18.91
  Top 0.5: Q3.4 5.16,18 | 13.49,18.91 R30.P$2
GHC
  Top 0.05: U7.16 21.06,21.24
  Top 0.384: R32.P$1 18.65,18.63 D11.1
  Top 0.5: R32.P$1 18.44,18.63 21.06,21.24
  pour Top (no thermals): 22.27,22.65 22.39,22.53 21.22,21.1 20.92,21.4
GHC_D
  Top 0.384: R32.P$2 17.63,17.39 D11.2
  Top 0.4: Q5.4 5.25,12.22 6.02,11.45 6.17,11.39 11.65,11.39 12.63,11.97 14.11,13.05 14.1,14.46 | 17.49,17.85 R32.P$2
  Top 0.5: 17.49,17.85 14.1,14.46
  pour Top: 10.66,11.42 11.46,11.42 11.45,11.22 10.6,11.22
GLA
  Top 0.05: U7.8 19.48,27.8
  Top 0.384: R27.P$1 17.13,31.33 D3.1
  Top 0.5: 19.48,27.8 17.4,29.88 R27.P$1
  pour Top (no thermals): 21.32,26.42 21.22,26.3 19.33,27.64 19.67,27.93
GLA_D
  Top 0.384: R27.P$2 17.17,32.93 D3.2 | D4.1 16.45,33.85
  Top 0.4: Q2.4 12.38,33.78 13.27,34.65 15.65,34.65
  Top 0.5: R27.P$2 17.4,32.9 16.45,33.85 15.65,34.65
GLB
  Top 0.05: U7.13 20.2,23.2
  Top 0.384: D6.1 18.44,22.13 R29.P$1
  Top 0.5: R29.P$1 19.27,22.77 19.77,22.77 20.2,23.2
  pour Top (no thermals): 21.2,23.7 21.32,23.58 20.38,23.06 20.1,23.41
GLB_D
  Top 0.384: D7.1 18.65,25.03 R29.P$2 D6.2
  Top 0.4: Q4.4 10.82,28 16.59,28 17.13,27.47
  Top 0.5: 17.13,27.47 17.13,24.91 R29.P$2
GLC
  Top 0.384: 21.04,18.01 20.99,17.92 R31.P$1
  Top 0.5: R31.P$1 21.25,18.15 21.25,19.58 22.12,20.45
  pour Top (no thermals): 23.02,21.98 23.14,21.86 23.08,21.8 22.93,21.25 22.91,21.22 22.3,20.32 22.06,20.32 21.99,20.39 21.99,20.62
  pour Top (no thermals): 21.1,19.3 22.2,19.3 22.2,18.5 22,18.5 21.1,17.6 20.8,17.9 21.1,18.2
GLC_D
  Top 0.384: 20.9,16.42 R31.P$2
  Top 0.4: 16.47,15.03 15.3,13.86 15.19,12.48 14.49,11.81 13.36,11.16 12.9,10.9 12.78,10.78 11.53,10.1 10.99,9.9 Q6.4
  Top 0.5: 16.47,15.03 18.13,15.03 R31.P$2 | D9.2 21.94,17.34 D10.1 20.93,16.4 20.9,16.42
GND  (via drill 0.25, 0.35)
  Top 0.152: U7.25 26.29,22.77 26.54,22.52 27.68,22.52 28.01,22.19 C42.P$1
  Top 0.384: SWD.4 41.47,33.75 v41.56,33.66 | C30.P$2 44.17,18.5 v44.56,18.11 | v32.1,7.7 v32.1,7 | v32.1,7.7 23.4,7.7 | 23.4,7.7 21.82,7.7 CAN1.3 | v29.88,15.16 v30.58,15.16 31.67,15.16 32.8,14.03 32.8,8.8 32.1,8.1 v32.1,7.7 | 23.4,7.7 23.1,7.4 v23.1,5.5
  Top 0.5: C16.P$2 29.55,17.25 v29.2,17.6 | C35.P$2 28.4,18.59 v28.4,18.1 | C36.P$2 v27.8,17.8 | C34.P$2 29.49,19.81 v29.7,19.6 | v40.56,16.77 v40.56,16.07 41.15,15.48 J3.6 | C42.P$1 28.15,22.1 v28.5,22.1
  Bottom 0.152: U5.5 19.55,23.65 19,23.09 19,20.57 19.47,20.09 24.04,20.09 v24.28,19.85 | v32.69,31.63 32.5,31.63 U3.49
  Bottom 0.254: U1.7 41.65,13.55 41.94,13.26 42.5,13.26 43.5,14.26 C3.P$2
  Bottom 0.384: v12.1,45.1 12.15,45.05 C19.P$2 | v14.3,45.1 14.3,44.55 C20.P$2 | v17.3,45.1 17.3,44.55 C21.P$2 | C15.P$2 27.04,21.32 26.76,21.6 26.02,21.6 U5.13 | C25.P$2 v27.51,45.34 | C26.P$2 v28.8,45.33 v28.81,45.34 | C27.P$2 v30.1,45.33 v30.11,45.34 | C28.P$2 31.37,45.28 v31.31,45.34 | C29.P$2 v32.7,45.33 v32.71,45.34 | C9.P$2 42.33,30.73 v42.06,30.46 | C7.P$2 36.13,27.25 v35.58,27.25 | v42.09,26.27 42.15,26.21 C6.P$2 41.79,24.54 v41.79,23.52 | v23.1,5.5 23.1,5.22 22.9,5.02 22.36,5.02 21.48,4.14 21.48,2.2 20.7,1.42 12.14,1.42 11.06,2.5 11.06,2.54 CANG.P$1
  Bottom 0.5: R18.P$2 C32.P$2 | R3.P$1 v29.88,15.16 | C15.P$2 27.75,21.32 28.5,22.07 v28.5,22.1 | C8.P$2 v34.87,37.57 v34.86,37.56
  other vias: 12.3,43 12.3,42.3 20.2,44.6 20.9,44.6 20.9,45.2 20,44 20.2,45.2 21.2,33.8 23.7,39.1 24.9,39.1 25.91,35.36 25.86,34.31 26.34,34.88 32.3,34.23 34.48,31.72 32.19,29.67 29.88,31.74 38.76,37.96 38.26,37.46 26.1,41.8 25.8,41.2 35.01,44.04 36.01,44.64 34.21,44.84 35.11,44.74 42.36,38.66 42.36,38.06 42.36,37.46 34.52,24.18 34.5,23.59 38.15,25.2 38.16,24.53 35,18.39 35.6,18.39 43.86,14.97 44.26,14.37 40.56,18.47 40.26,17.97 43.46,18.61 39.81,9.04 39.81,8.46
  pour Route2 (isolate 0.5, no thermals): 9.3,45.5 42,45.5 45.5,42 45.5,16.1 31.2,16.1 26.6,20.7 26.6,40.8 9.3,40.8
  pour Bottom (no thermals): 18.4,45.7 21.2,45.7 21.2,43.7 18.4,43.7
  pour Bottom (no thermals): 42.3,11.2 40.7,11.2 40.7,8.5 42.3,8.5
  pour Bottom (no thermals): 44.6,15.2 43,15.2 43,14 44.6,14
  pour Bottom (no thermals): 40.5,20.2 39.9,20.2 39.9,17.7 40.8,17.7 40.8,19.1 40.5,19.4
  pour Bottom (no thermals): 44.8,19.5 43.4,19.5 43.4,17.9 44.8,17.9
  pour Bottom (no thermals): 42.7,26 41.7,26 41.7,24.3 42.7,24.3
  pour Route2 (isolate 0.5, no thermals): 37.9,16.6 45.5,16.6 45.5,9.1 39.8,9.1 37.9,11
  pour Bottom (no thermals): 33.9,45.1 36.9,45.1 36.9,43.7 33.9,43.7
  pour Route2 (no thermals): 20.3,41 27.2,41 27.2,33.6 20.3,33.6
  pour Top (no thermals): 25.5,42 26.6,42 26.6,39.9 25.6,39.9 25.5,40
  pour Route2 (no thermals): 25.8,25.1 28.7,25.1 28.7,19.5 28.2,19 25.8,19
  pour Route2 (rank 3, no thermals): 23.5,20.9 31.1,20.9 31.1,14.8 23.6,14.8 23.6,20.8
  pour Bottom (no thermals): 21,34.7 21.8,34.7 21.9,34.6 21.9,33 21,33
  pour Bottom (no thermals): 23.4,39.5 25.1,39.5 25.2,39.4 25.2,38.5 23.5,38.5 23.3,38.7 23.3,39 23.3,39.4
  pour Bottom (no thermals): 25.7,35.6 26.3,35.6 26.3,35.3 26.7,34.9 26.9,34.7 27.3,34.7 27.3,34.2 26.3,34.2 26.2,34.2 25.9,33.9 25.6,33.9 25.6,35.5
  pour Bottom (no thermals): 36.9,38.2 39,38.2 39,37.8 38.5,37.3 38.4,37.2 37.2,37.2 36.9,37.5
  pour Bottom (no thermals): 42,39 43,39 43.1,38.9 43.1,37.1 42.1,37.1 42,37.2
  pour Top (no thermals): 33.7,24.4 34.8,24.4 34.8,23.2 34.2,22.6 33.9,22.6 33.7,22.8
  pour Top (no thermals): 37.6,25.5 39.1,25.5 39.1,24.1 37.6,24.1
  pour Top (no thermals): 34.6,18.7 36.3,18.7 36.3,16.5 34.6,16.5
  pour Bottom (no thermals): 30.9,8.7 32.2,8.7 32.2,6.7 30.9,6.7
  pour Route2 (no thermals): 41,10.4 39,10.4 39,8.2 40.8,8.2 41,8.4
  pour Bottom (no thermals): 41.3,9.5 39.9,9.5 39.4,9 39.4,8.2 41.2,8.2 41.3,8.3
  pour Route2 (no thermals): 26.4,20.4 23.9,20.4 23.9,19.3 24,19.2 26.4,19.2
  pour Top (no thermals): 11.9,43.4 13,43.4 13,41.5 12.9,41.4 12.9,40.7 12.4,40.7 12.4,41.5 11.9,42
LED1  (via drill 0.25)
  Top 0.152: v32.4,2.6 32.1,2.6 29.6,5.1 26.1,5.1 v25.6,5.6
  Bottom 0.152: U3.28 30.94,37.84 33,39.9 43.9,39.9 44.7,39.09 44.7,25.13 45.54,24.29 45.54,7.14 44.5,6.1 43.4,6.1 41.91,7.59 37.79,7.59 37.3,7.11 37.3,4.61 35.3,2.6 v32.4,2.6 | v25.6,5.6 26.45,5.6 D1.CATHODE
LED2  (via drill 0.25)
  Top 0.152: v33,3.2 30.6,5.6 v30.2,5.6
  Bottom 0.152: U3.29 31.44,37.91 33.13,39.59 43.77,39.59 44.4,38.97 44.4,25 45.23,24.17 45.23,7.27 44.37,6.41 43.59,6.41 42.11,7.89 37.59,7.89 37,7.3 37,4.73 35.47,3.2 v33,3.2 | v30.2,5.6 28.05,5.6 D2.CATHODE
MOTOR1  (via drill 0.25)
  Top 0.152: U7.32 27.96,26.1 29.9,26.1 v30.2,26.4
  Bottom 0.152: v30.2,26.4 31.44,27.64 U3.8
MOTOR2  (via drill 0.25)
  Top 0.152: v29.21,26.61 28.81,27.01 28.81,27.02 28.51,27.32 27.99,27.32 27.19,26.52 U7.34
  Bottom 0.152: v29.21,26.61 29.61,26.61 30.94,27.94 U3.9
MOTOR3  (via drill 0.25)
  Top 0.152: v27.71,27.91 26.99,27.91 26.31,27.23 U7.36
  Bottom 0.152: v27.71,27.91 28.5,27.12 29.61,27.12 30.44,27.94 U3.10
MOTOR_ENABLE  (via drill 0.25)
  Top 0.152: U7.31 28.16,25.59 v28.7,25.59
  Bottom 0.152: U3.3 33.94,26.48 32.46,25 31.72,25 31.14,25.57 28.7,25.57 v28.7,25.59
MOTOR_FAULT  (via drill 0.25)
  Top 0.152: U7.26 26.65,23.13 26.95,22.83 28.5,22.83 29.09,22.23 29.97,22.23 30.3,22.57 30.3,23.07 31.03,23.8 31.66,23.8 32.56,24.7 34.62,24.7 37.37,27.45 | 37.37,27.45 38.72,28.8 38.72,32.02 38.84,32.15 38.84,33.85 37.76,34.94 37.76,36.74 35.4,39.1 30.7,39.1 v30.49,38.89 | R26.P$2 37.55,27.45 37.37,27.45
  Bottom 0.152: v30.49,38.89 29.94,38.34 U3.26
MOTOR_HIZ  (via drill 0.25)
  Top 0.152: U7.33 28.08,26.93 v28.4,26.61 | v27.2,27.4 27.14,27.4 U7.35 | v27.49,28.6 26.93,28.6 U7.37
  Bottom 0.152: v27.49,28.6 27.2,28.31 v27.2,27.4 27.61,27.4 v28.4,26.61 28.49,26.61 29.21,25.89 31.26,25.89 31.85,25.3 32.33,25.3 33.44,26.41 U3.4
N$1
  Bottom 0.5: 40.02,5.78 C1.P$1 39.7,7.01 R1.P$1 | 40.02,5.78 | 40.02,5.78 42.8,3 M3.P$1
N$2
  Top 0.254: U7.40 24.85,29.83 C40.P$2
N$3  (via drill 0.25)
  Top 0.152: AUX2.3 17.61,41.19
  Top 0.348: 17.61,41.19 v17.61,42.75
  Bottom 0.152: v17.61,42.75 17.8,42.55 R4.P$1
N$4
  Bottom 0.254: C3.P$1 41.35,12.85 41.15,12.65 U1.3
N$5
  Bottom 0.5: U2.5 41.15,21.75 41.95,20.95 L2.2
N$6  (via drill 0.25)
  Top 0.152: 16.4,42.73 v16.44,42.77
  Top 0.348: AUX2.4 16.4,42.73
  Bottom 0.152: v16.44,42.77 16.5,42.7 R5.P$1
N$7  (via drill 0.25)
  Top 0.152: AUX2.6 13.9,41.12
  Top 0.348: 13.9,41.12 v13.38,40.6
  Bottom 0.152: R8.P$1 13.38,42.27 v13.38,40.6
N$8  (via drill 0.25)
  Top 0.348: v14.63,41.51 14.79,41.51 AUX2.5
  Bottom 0.152: R9.P$1 14.63,41.58 v14.63,41.51
N$9  (via drill 0.25)
  Top 0.384: AUX1.3 32.56,41.15 v32.51,41.2
  Bottom 0.384: v32.51,41.2 32.51,41.46 R10.P$1
N$10
  Top 0.152: U7.1 23.93,28.84 21.63,31.15 21.63,32.4 C39.P$2
N$11  (via drill 0.25)
  Top 0.384: AUX1.4 31.26,41.15 v31.21,41.2
  Bottom 0.384: v31.21,41.2 31.21,41.49 R11.P$1
N$12  (via drill 0.25)
  Top 0.384: AUX1.5 30.04,41.15 v29.99,41.2
  Bottom 0.384: v29.99,41.2 29.99,41.53 R12.P$1
N$13
  Top 0.152: U7.2 23.3,28.57 23.3,29 20.76,31.54 C39.P$1
N$14
  Top 0.152: U7.5 21.69,28.05 C38.P$2
N$15  (via drill 0.25)
  Top 0.384: AUX1.6 28.76,41.15 v28.71,41.2
  Bottom 0.384: v28.71,41.2 28.71,41.56 R13.P$1
N$16
  Top 0.254: U7.38 26.18,28.56 C41.P$2
N$17
  Bottom 0.5: R20.P$2 26.35,7.4 D1.ANODE
N$18
  Bottom 0.5: R21.P$2 29.55,8.7 D2.ANODE
N$19  (via drill 0.25)
  Top 0.384: AUX1.7 27.89,41.23 v27.59,41.23
  Bottom 0.384: v27.59,41.23 27.5,41.32 R14.P$1
NRST  (via drill 0.25)
  Top 0.152: v32.12,25.82 32.36,26.06 33.66,26.06 37.2,29.6 v37.38,29.6 | v40.41,31.47 40.36,31.42 40.36,30.79 SWD.2 40.05,30.75 v39.4,30.1
  Bottom 0.152: U3.7 31.94,26 v32.12,25.82 | v39.4,30.1 37.88,30.1 v37.38,29.6 | C9.P$1 40.93,30.95 v40.41,31.47
RS422_A
  Top 0.2: U8.12 42.77,19.14 42.35,18.72 42.35,16.45 42.85,15.95 42.85,11.15 42.45,10.75 41.57,10.75 J3.2 39.02,10.32 R35.P$2
RS422_B
  Top 0.2: U8.11 41.5,19.24 41.97,18.77 41.97,16.33 42.5,15.8 42.5,11.3 42.3,11.1 41.62,11.1 J3.3 38.92,11.57 R35.P$1
RS422_DE  (via drill 0.25)
  Top 0.152: v28.31,35.38 31.01,35.38 31.26,35.63 34.79,35.63 v35.42,36.26 | v42.06,28.3 41.96,28.2 41.96,26.96 41.5,26.5 U8.4
  Bottom 0.152: U3.24 28.74,34.95 v28.31,35.38 | v35.42,36.26 35.86,36.7 41.5,36.7 43.4,34.8 43.4,29.64 v42.06,28.3
RS422_RE  (via drill 0.25)
  Top 0.152: v27.82,33.83 27.93,33.92 27.93,34.52 28.25,34.85 31.08,34.85 31.55,35.32 35.49,35.32 v35.93,35.77 | v42.46,29.8 42.6,29.66 42.6,25.13 U8.3
  Bottom 0.152: U3.22 27.96,33.69 v27.82,33.83 | v35.93,35.77 36.56,36.4 41.37,36.4 43.08,34.68 43.08,30.42 v42.46,29.8
RS422_Y
  Top 0.2: U8.9 38.96,19.04 39.37,18.63 39.37,16.87 37.95,15.45 37.95,13.67 38.34,13.28 38.73,13.28 38.9,13.11 R36.P$2 41.02,12.95 J3.4
RS422_Z
  Top 0.2: U8.10 40.23,19.13 39.72,18.62 39.72,16.72 38.3,15.3 38.3,13.82 38.47,13.65 38.75,13.65 38.9,13.8 R36.P$1 41.12,14.05 J3.5
SHA
  Top 0.05: U7.7 19.85,28.35
  Top 0.2: 18.3,34.2 17.27,35.23
  Top 0.3: Q2.5 5.31,34.13 5.53,34.39 5.91,34.52 12.2,34.52 12.91,35.23
  Top 0.35: 17.27,35.23 12.91,35.23
  Top 0.5: 18.3,34.2 18.3,29.9 19.85,28.35 | Q2.6 7.39,31.94 Q2.PAD
  pour Top (no thermals): 21.68,26.77 21.56,26.65 19.72,28.17 20.03,28.49
  pour Top (no thermals): 12.38,34.51 12.21,34.7 12.82,35.34 13,35.18
  pour Top (no thermals): 17.16,35.08 17.32,35.37 18.47,34.35 18.07,34.21 17.29,35.08
  pour Top (isolate 0.4, no thermals): 5.5,39.9 5.5,36.6 4.38,36.6 3.9,35.97 3.9,35.2 5.7,34.1 5.7,29.4 4.5,29.4 4.5,30.6 4.1,31 0.3,31 0.3,39.9
SHB
  Top 0.05: U7.14 20.31,22.39
  Top 0.3: Q4.8 6.07,23.01 14.02,23.01
  Top 0.5: 14.02,23.01 15.32,21.71 17.37,21.71 17.9,21.3 19.22,21.3 20.31,22.39 | 20.31,22.39 | Q4.6 7.39,26.64 Q4.PAD
  pour Top (no thermals): 21.56,23.36 21.69,23.24 20.47,22.22 20.17,22.57
  pour Top (no thermals): 5.6,28.2 5.6,19.4 4.5,19.4 4.5,20.3 3.9,20.9 0.3,20.9 0.3,25.1 3.9,25.1 4.5,25.7 4.5,28.2
  pour Top (no thermals): 14.06,23.23 13.15,23.13 13.15,22.88 14.3,22.75
SHC
  Top 0.152: U7.17 21.47,20.73
  Top 0.28: 5.23,10.83 11.77,10.83 14.09,12.2 14.67,12.89 14.7,14.12
  Top 0.3: 5,10.6 5.23,10.83
  Top 0.4: 14.7,14.12 16.27,15.7
  Top 0.5: Q6.5 5,10.6 | 21.47,20.73 20.44,19.7 20.44,18.41 17.73,15.7 16.27,15.7 | Q6.6 7.39,9.04 Q6.PAD
  pour Top (no thermals): 22.63,22.29 22.75,22.17 21.64,20.62 21.33,20.91
  pour Top (isolate 0.4, no thermals): 5.7,16.3 5.7,13.2 4.6,13.2 4,12.6 4,11.5 5.6,9.9 5.6,6.1 0.3,6.1 0.3,14.9 3.6,14.9 4.5,15.8 4.5,16.3
  pour Top (no thermals): 16.17,15.91 15.34,14.87 15.49,14.74 16.31,15.51 16.55,15.51 16.55,15.92 16.33,15.91
SWCLK  (via drill 0.25)
  Top 0.152: SWD.5 40.2,35.45 38.63,35.45 v38.57,35.51
  Bottom 0.152: v38.57,35.51 37.85,34.79 35.74,34.79 U3.37
SWDIO  (via drill 0.25)
  Top 0.152: SWD.3 39.47,33.18 39.47,34.5 39.1,34.87 v39.1,34.94
  Bottom 0.152: v39.1,34.94 39.1,35.7 38.78,36.02 37.37,36.02 36.45,35.1 34.94,35.1 U3.36
SXA_N
  Top 0.2: SH1.1 13.61,30.6 15.4,30.6 19.43,26.56 19.91,26.3 U7.10
SXA_P
  Top 0.2: RA.2 13.3,32.21 13.3,31.3 13.6,31 15.5,31 19.55,26.95 20.21,26.61 U7.9
  pour Top (isolate 0.4, no thermals): 12.13,32.81 13.52,34.2 15.2,34.2 15.2,32.3 14.4,31.5 12.6,31.5 11.4,30.3 11.4,29.4 10,29.4 10,32.8
SXB_N
  Top 0.2: SH2.1 14.1,26.33 14.1,24.4 15.9,22.6 17.2,22.6 18.85,24.25 20.46,24.25 U7.11
SXB_P
  Top 0.2: RB.2 13.4,26.6 13.7,26.3 13.7,24.3 15.75,22.25 17.35,22.25 19,23.9 20.82,23.9 U7.12
  pour Top (no thermals): 10.2,27 12.8,27 12.8,24.5 12,23.7 10.2,23.7
SXC_N
  Top 0.2: U7.20 23.55,20.98 23.28,20.44 23.03,20.04 23.03,16.93 19.85,13.75 19.85,11.95 18.45,10.55 17.45,10.55 15.6,8.7 15.6,8.3 14.4,7.1 13.27,7.1 SH3.1
SXC_P
  Top 0.2: U7.19 23.36,21.5 22.94,20.65 22.68,20.2 22.68,17.08 19.5,13.9 19.5,12.12 18.28,10.9 17.3,10.9 15.2,8.8 15.2,8.4 14.25,7.45 13.45,7.45 12.9,8 RC.2
  pour Top (no thermals): 14.61,11.32 15.03,10.66 14.2,10.22 14.2,9.5 10.8,6.1 10,6.1 10.1,6.2 10.1,9.4 11.4,9.4
V+  (via drill 0.25)
  Top 0.5: Q1.PAD 8.29,37.8 v8.11,37.27 | Q1.8 10.08,39.89 v9.91,39.73 | Q1.7 10.24,38.57 v9.91,38.43 | Q1.6 9.99,37.35 v9.91,37.27 | Q1.5 10.22,36.03 v9.91,35.92 | Q5.5 10.1,12.29 v9.91,12.23 | Q5.PAD 8.46,13.54 v9.01,12.23 | Q5.PAD Q5.7 | Q5.PAD 8.56,14.34 8.56,15.94 8.57,15.96 8.95,15.93 Q5.8 | Q5.6 v9.01,13.49 9.01,14.81 Q5.PAD | Q3.5 10.13,18.41 v9.91,18.13 | Q3.6 10.09,19.71 v9.91,19.48 | Q3.7 9.91,21.05 v9.91,20.73 | Q3.8 10.1,22 9.91,22.07 v9.91,22.03 | Q3.PAD 8.11,20.41 v8.11,20.73
  Bottom 0.5: R15.P$2 19.27,35.53 v19.2,35.6
  other vias: 7.22,39.73 8.11,39.73 9.01,39.73 7.22,38.43 8.11,38.43 9.01,38.43 7.22,37.27 9.01,37.27 7.22,35.92 8.11,35.92 9.01,35.92 7.22,22.03 8.11,22.03 9.01,22.03 7.22,20.73 9.01,20.73 7.22,19.48 8.11,19.48 9.01,19.48 7.22,18.13 8.11,18.13 9.01,18.13 7.22,16.03 8.11,16.03 9.01,16.03 9.91,16.03 7.22,14.73 8.11,14.73 9.01,14.73 9.91,14.73 7.22,13.49 8.11,13.49 9.91,13.49 7.22,12.23 8.11,12.23 11.8,37.57 12.4,37.57 11.71,39.63 13.01,38.93 13.01,38.23 13.01,37.58 13.01,21.13 13.01,20.53 13.01,19.93 13.53,19.65 13.53,20.25 13.56,20.87 13.56,21.52 13.57,22.16 11.81,13.93 11.81,14.63 11.81,15.33 12.51,15.03 13.09,16.59 12.31,16.43 12.41,14.33 11.78,15.97 20.1,30.4 20.6,30 19.8,31 19.7,34.6 20.3,34.6 19.7,34 20.3,34 19.7,33.4 20.3,33.4 20.3,32.8 19.7,32.8 19.7,35.2 18.8,36.1 17.33,16.55 19.73,18.75 22.13,10.65 23.63,18.85 24.23,18.85 21.53,10.65 20.93,10.65 21.83,10.15 23.93,18.35 21.23,10.15 24.53,16.35 23.93,16.35 24.23,16.85 23.63,16.85 23.93,17.35 24.53,17.35 23.63,17.85 24.23,17.85 25.41,12.13 26.01,12.13 26.61,12.13 27.21,12.13 26.91,12.63 26.31,12.63 25.71,12.63 25.01,11.63 25.01,11.03 25.01,10.43 25.01,9.83 44.21,10.83 43.61,10.83 44.61,11.53 20.63,10.15 20.33,10.65 20.03,10.15 19.73,10.65 19.43,10.15 22.43,10.15
  pour Route15 (isolate 0.5, rank 2, no thermals): 0.5,41.4 26.2,41.4 26.2,17.7 28.9,15 45.5,15 45.5,4 42,0.5 4,0.5 0.5,4
  pour Bottom (isolate 0.4, no thermals): 44.9,12.1 41.5,12.1 41.5,11.6 42.8,11.6 42.8,10.5 44.9,10.5
  pour Top (no thermals): 10.3,39.9 11.7,39.9 12.2,39.4 13.8,39.4 13.8,38.2 14.6,37.4 14.6,36.3 13.6,36.3 13.6,37.3 11.3,37.3 11.3,35.9 11.1,35.7 10.3,35.7
  pour Top (no thermals): 10.2,22.4 13.6,22.4 13.8,22.2 13.8,19.7 13.5,19.4 11.8,19.4 11.5,19.1 11.5,18.1 10.2,18.1
  pour Top (no thermals): 10.7,16.3 11.9,16.3 12.5,16.9 13.5,16.9 13.5,13.2 11.5,12 10.6,12
  pour Bottom (rank 2, no thermals): 10.3,40.5 7.7,40.5 7.7,6.1 7.8,6 10.7,6 10.7,40.1
  pour Bottom (isolate 0.4, no thermals): 18.4,36.8 16.4,36.8 16.4,15.8 17.2,15 19.2,15 19.2,20.5 18.3,21.4 18.3,22.1 18.3,24.9 18.6,25.2 18.6,36.6
  pour Top (isolate 0.4, rank 2, no thermals): 19.8,31.3 20.4,30.7 21.1,30.7 23.1,28.7 23.1,28.2 23.4,27.9 22.9,27.4 22.5,27.8 22.5,28.5 21.8,29.2 21.5,29.2 21.1,28.8 20.9,28.8 19.5,30.2 19.5,31
  pour Bottom (no thermals): 17.6,36.6 19.1,36.6 20.5,35.2 20.6,35.1 20.6,32.5 19.9,31.8 17.5,31.8 17.5,36.5
  pour Bottom (isolate 0.4, rank 3, no thermals): 18.4,19.3 25,19.3 25,15.1 18.4,15.1
  pour Top (no thermals): 24.8,12.9 27.6,12.9 27.6,9.9 25.7,9.9 25.3,9.5 24.7,9.5 24.7,12.8
  pour Bottom (isolate 0.5, no thermals): 10.9,6.7 7.7,6.7 7.7,0.5 22.6,0.5 22.6,5.3 22.5,5.4 12.05,5.37
  pour Bottom (isolate 0.4, rank 3, no thermals): 21.3,16.6 21.1,16.4 16.6,16.4 16.6,14.9 15.3,13.6 15.3,4.7 15.2,4.6 22.6,4.6 22.6,15.3
  pour Bottom (isolate 0.4, rank 3, no thermals): 37.5,14.6 34.8,14.6 33.4,13.2 33.4,12.6 32,11.2 20.6,11.2 20.6,8.3 32.1,8.3 34,10.2 37.5,10.2
  pour Bottom (isolate 0.4, no thermals): 27.6,10.8 27.6,12.6 27.3,12.9 25.6,12.9 25.3,12.6 24.7,12 24.7,11 24.7,10.7 24.8,10.8
V-  (via drill 0.25)
  Top 0.152: U7.39 25.5,28.59 25.5,29 25.92,29.42 26.8,29.42 C41.P$1 | SH1.2 RA.1
  Top 0.25: U7.39 23.66,26.75 v23.66,26.73 | v24.33,26.03 24.33,25.06 U7.PAD
  Top 0.384: D4.2 17.04,34.37 v17.04,34.45 | D7.2 18.63,26.17 v18.84,26.38 | v20.36,15.72 20.32,15.72 D10.2 | SH2.2 RB.1
  Bottom 0.5: R1.P$2 C1.P$2 38.64,5.74 v38.64,4.92
  other vias: 14.69,30.05 14.67,29.43 15.18,29.1 15.21,29.72 15.73,29.39 12.19,30.15 12.08,29.53 12.07,28.9 12.66,30.58 14.66,28.82 15.71,28.8 15.96,25.32 15.36,25.32 14.76,25.32 14.76,24.72 15.36,24.72 15.96,24.72 15.96,24.12 15.36,24.12 15.96,23.52 16.56,24.12 14.31,27.22 16.25,27.19 16.26,26.56 16.26,25.92 14.46,21.42 14.46,20.82 14.46,20.22 14.46,19.62 15.86,20.82 15.86,20.22 16.46,20.82 16.46,20.22 14.56,17.22 14.06,16.92 14.06,16.32 14.66,16.32 14.96,16.82 15.56,18.22 16.06,17.72 15.16,5.92 14.86,6.42 15.16,4.82 15.46,5.42 12.16,4.82 12.76,4.82 14.86,5.42 14.16,6.42 14.56,5.92 15.46,6.42 15.76,4.82 13.36,4.82 14.26,5.42 14.56,4.82 13.96,4.82 15.99,39.05 14.49,39.05 14.49,38.45 16.59,38.45 15.99,38.45 15.99,37.85 16.59,39.05 16.59,37.85 0.59,39.65 1.19,39.65 0.89,39.15 1.49,39.15 0.59,38.65 1.19,38.65 1.79,39.65 0.89,38.15 0.59,37.65 2.39,39.65 2.99,39.65 2.09,39.15 2.69,39.15 1.79,38.65 1.49,38.15 1.19,37.65 0.89,37.15 0.59,6.35 1.19,6.35 1.79,6.35 2.39,6.35 2.99,6.35 2.69,6.85 2.09,6.85 1.49,6.85 0.89,6.85 0.59,7.35 1.19,7.35 1.79,7.35 2.39,7.35 2.09,7.85 1.49,7.85 0.89,7.85 0.59,8.35 1.19,8.35 1.79,8.35 1.49,8.85 0.89,8.85 1.19,9.35 0.59,9.35 0.89,9.85 2.39,38.65 2.09,38.15 1.79,37.65 1.49,37.15 1.19,36.65 0.59,36.65 0.89,36.15 22.8,32.2 23.3,31.8 23.5,30.9 22.63,25.74 24.4,24 23.66,23.3 22.64,24.32 23.35,25.03 25.46,14.72 26.06,14.72 26.66,14.72 27.26,14.72 26.96,14.22 26.36,14.22 25.76,14.22 25.46,13.72 26.06,13.72 26.66,13.72 27.26,13.72 44.26,8.22 43.66,8.22 43.06,8.22 15.26,31.55 15.77,31.87 15.76,32.47 15.76,33.07
  pour Route2 (isolate 0.5, rank 2, no thermals): 0.5,40 26.2,40 26.2,16.7 28.6,14.3 45.5,14.3 45.5,4 42,0.5 4,0.5 0.5,4
  pour Bottom (isolate 0.5, no thermals): 44.5,10.1 42.8,10.1 42.8,7.9 44.5,7.9
  pour Route15 (isolate 0.5, no thermals): 0.5,40 6.4,40 6.4,26.2 0.4,26.2 0.4,39.9
  pour Route2 (isolate 0.5): 0.6,38.2 0.6,41.8 6.1,45.5 8.4,45.5 8.4,38.2
  pour Top (isolate 0.3, rank 2, no thermals): 11.7,31 13,31 13,30.1 13.8,30.1 14,30.3 15.3,30.3 16.1,29.5 16.1,28.5 11.7,28.5
  pour Top (no thermals): 14.5,26.1 16.1,26.1 16.1,25 16.9,24.2 15.9,23.2 14.5,24.6
  pour Top (no thermals): 14,27.5 16.3,27.5 16.5,27.3 16.5,25.6 16,25.6 15.3,26.3 15.3,26.9 14,26.9
  pour Top (no thermals): 14.2,21.8 14.4,21.8 15.1,21.1 16.7,21.1 16.7,20 15.8,20 15.6,19.8 15.6,19.4 14.2,19.4
  pour Top (isolate 0.2, no thermals): 13.8,18.4 15.7,18.4 16.4,17.7 14.6,15.9 14.1,15.9 13.8,16.2
  pour Top (no thermals): 12.1,6.6 16.1,6.6 16.1,4.5 11.8,4.5 11.8,6.3
  pour Top (no thermals): 14.3,39.4 16.8,39.4 16.8,37.6 15,37.6 14.3,38.3
  pour Bottom (no thermals): 6.5,40.5 4.9,40.5 4.9,5.9 5,5.8 6.6,5.8 6.6,40.4
  pour Bottom (no thermals): 5.9,30.3 0.3,30.3 0.3,25.9 0.4,25.8 6.1,25.8 6.1,30.1
  pour Bottom (no thermals): 6.5,40 0.3,40 0.3,36 6.5,36
  pour Bottom (no thermals): 6.4,10.2 0.3,10.2 0.3,6.1 6.4,6.1
  pour Bottom (isolate 0.4, rank 2, no thermals): 14.7,36.5 13.9,36.5 12.2,34.8 12.2,34.3 11.7,33.8 11.7,6.1 16.6,6.1 16.9,6.4 16.9,8.7 14.8,10.8 14.8,13.5 16,14.7 16,17 15.9,17.1 15.9,35.3
  pour Top (no thermals): 22.7,32.6 22.9,32.6 23.8,31.7 24.5,31 24.5,30.6 24.5,30.5 23.7,29.7 23,30.4 23,31 22.2,31.8 22.2,31.9 22.2,32.1
  pour Top (no thermals): 25.3,16.8 27.5,16.8 27.5,13.4 25.3,13.4
  pour Bottom (isolate 0.4, rank 2, no thermals): 20.8,13.6 22.7,15.5 31,15.5 32.9,13.6 32.9,12.3 32.1,11.5 21.4,11.5 20.8,12.1
  pour Route2 (no thermals): 27.8,15.4 24.8,15.4 24.7,15.3 24.7,13.6 24.8,13.5 27.8,13.5
VBAT_SENSE  (via drill 0.25)
  Top 0.152: v32.4,36.3 31.5,36.3 30.9,35.7 29,35.7 28.52,36.19 23.49,36.19 v23.3,36
  Bottom 0.152: U3.31 32.4,35.43 v32.4,36.3 | v23.3,36 22.83,35.53 R15.P$1 R16.P$2 C31.P$1
VSW
  Bottom 0.254: U1.8 42.15,16.47 L1.2
VTEMP_FET  (via drill 0.25)
  Top 0.152: v29.3,36.22 29,36.53 22.53,36.53 v22.5,36.5 | v12.69,36.5 12.84,36.65 R17.P$2
  Bottom 0.152: v12.69,36.5 12.82,36.62 13.36,36.62 13.89,37.16 13.89,39.39 14.15,39.65 16.85,39.65 17.17,39.33 17.17,38.03 17.8,37.4 C32.P$1 22.75,36.5 v22.5,36.5 | U3.25 29.44,36.08 v29.3,36.22
  Bottom 0.5: R18.P$1 C32.P$1
VTEMP_MOT  (via drill 0.25)
  Top 0.348: TEMP2.P$1 38.2,43 38.2,41 39,40.2 v39,39.09
  Bottom 0.152: U3.30 31.85,35.48 31.85,37.89 33.25,39.29 36.96,39.29 C33.P$1 R19.P$1 38.96,39.05 v39,39.09

## Text on the board
tPlace: G | D | C | B | A | 3 | 5 | G | E | D | C | B | A | 3 | 5 | A | - | B | + | C
tNames: TEMP | (c) 2023 | moteus-n1 | r1.2 | T | R | D | 3 | G | 5 | G | Z | Y | B | A | H | L | G | 5 | CAN | H | L | G
bNames: G | L | H